# EasyEDA Pro project NUEVO board Rev. B.epro, schematic Schematic1

## Sheets
1 Power: Board Name: Carrier_1; Create Date: 2025-11-06; Page Name: Power; Project Name: 162 Carrier Board; Schematic Name: Schematic1; Update Date: 2026-01-30; Company: EasyEDA.com; Page Size: A4; Version: V1.0
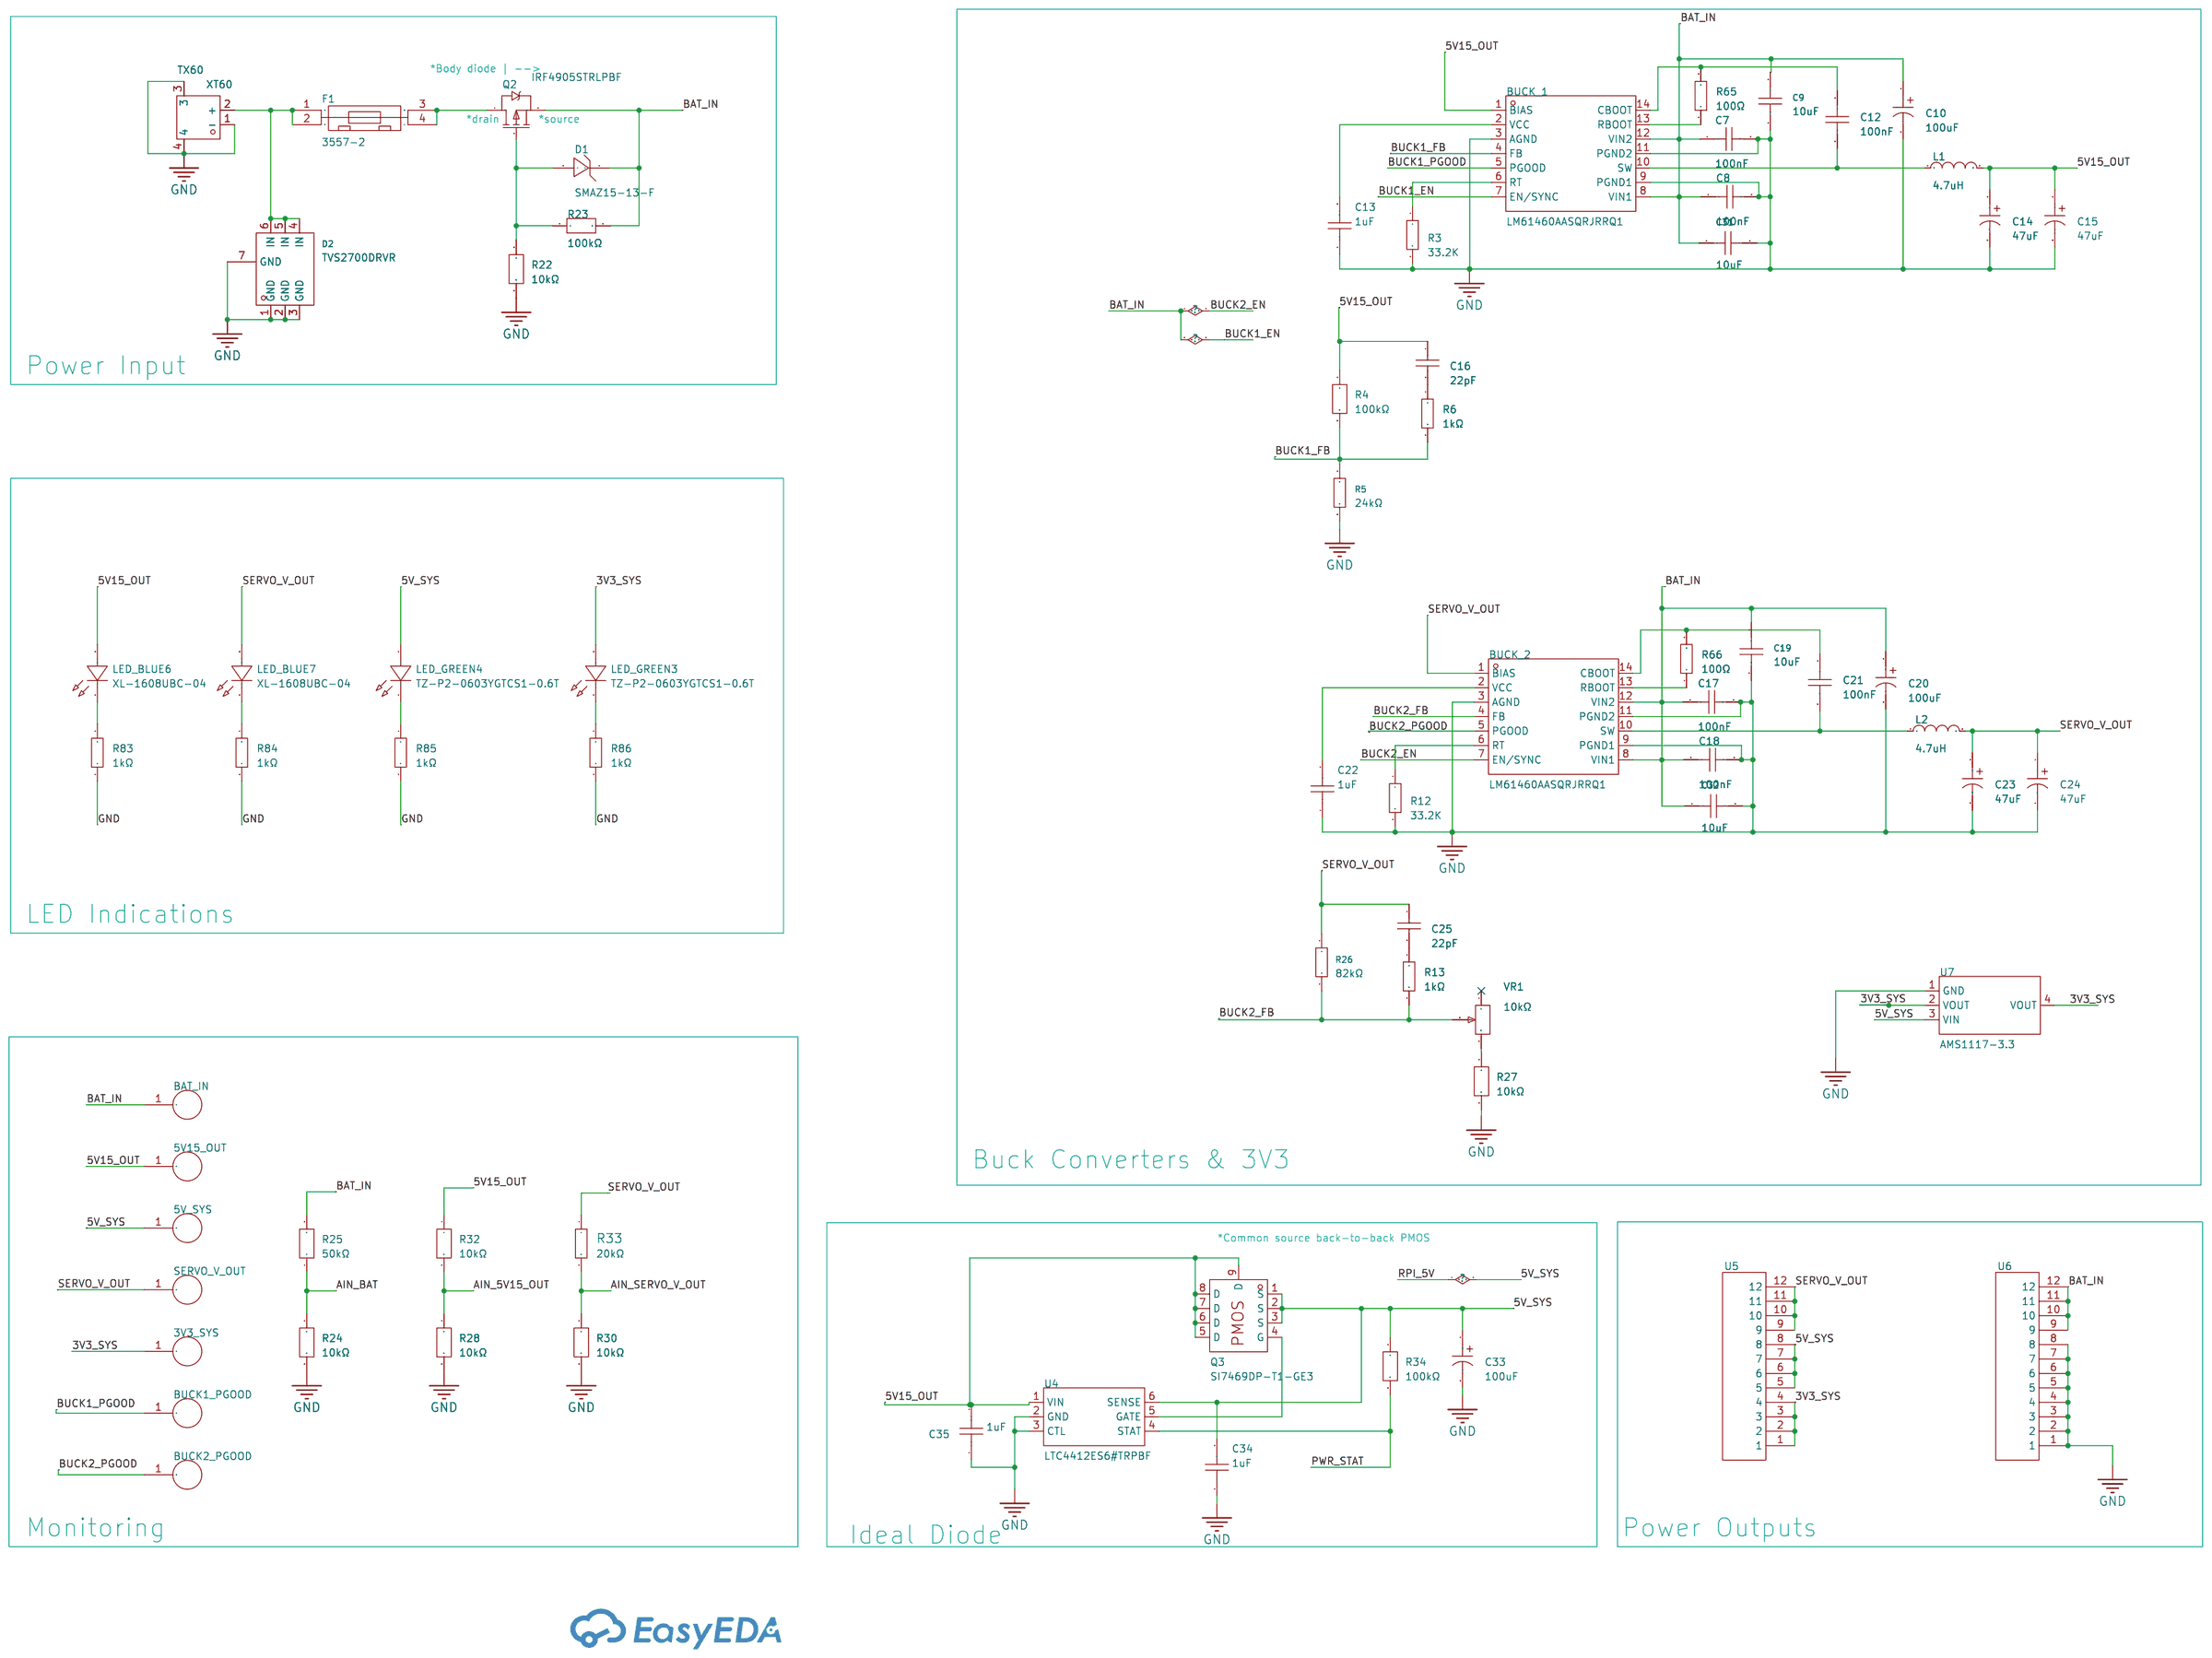
[diagram p1: Power]
2 Motors+UI: Page Name: Motors+UI; Update Date: 2026-01-31
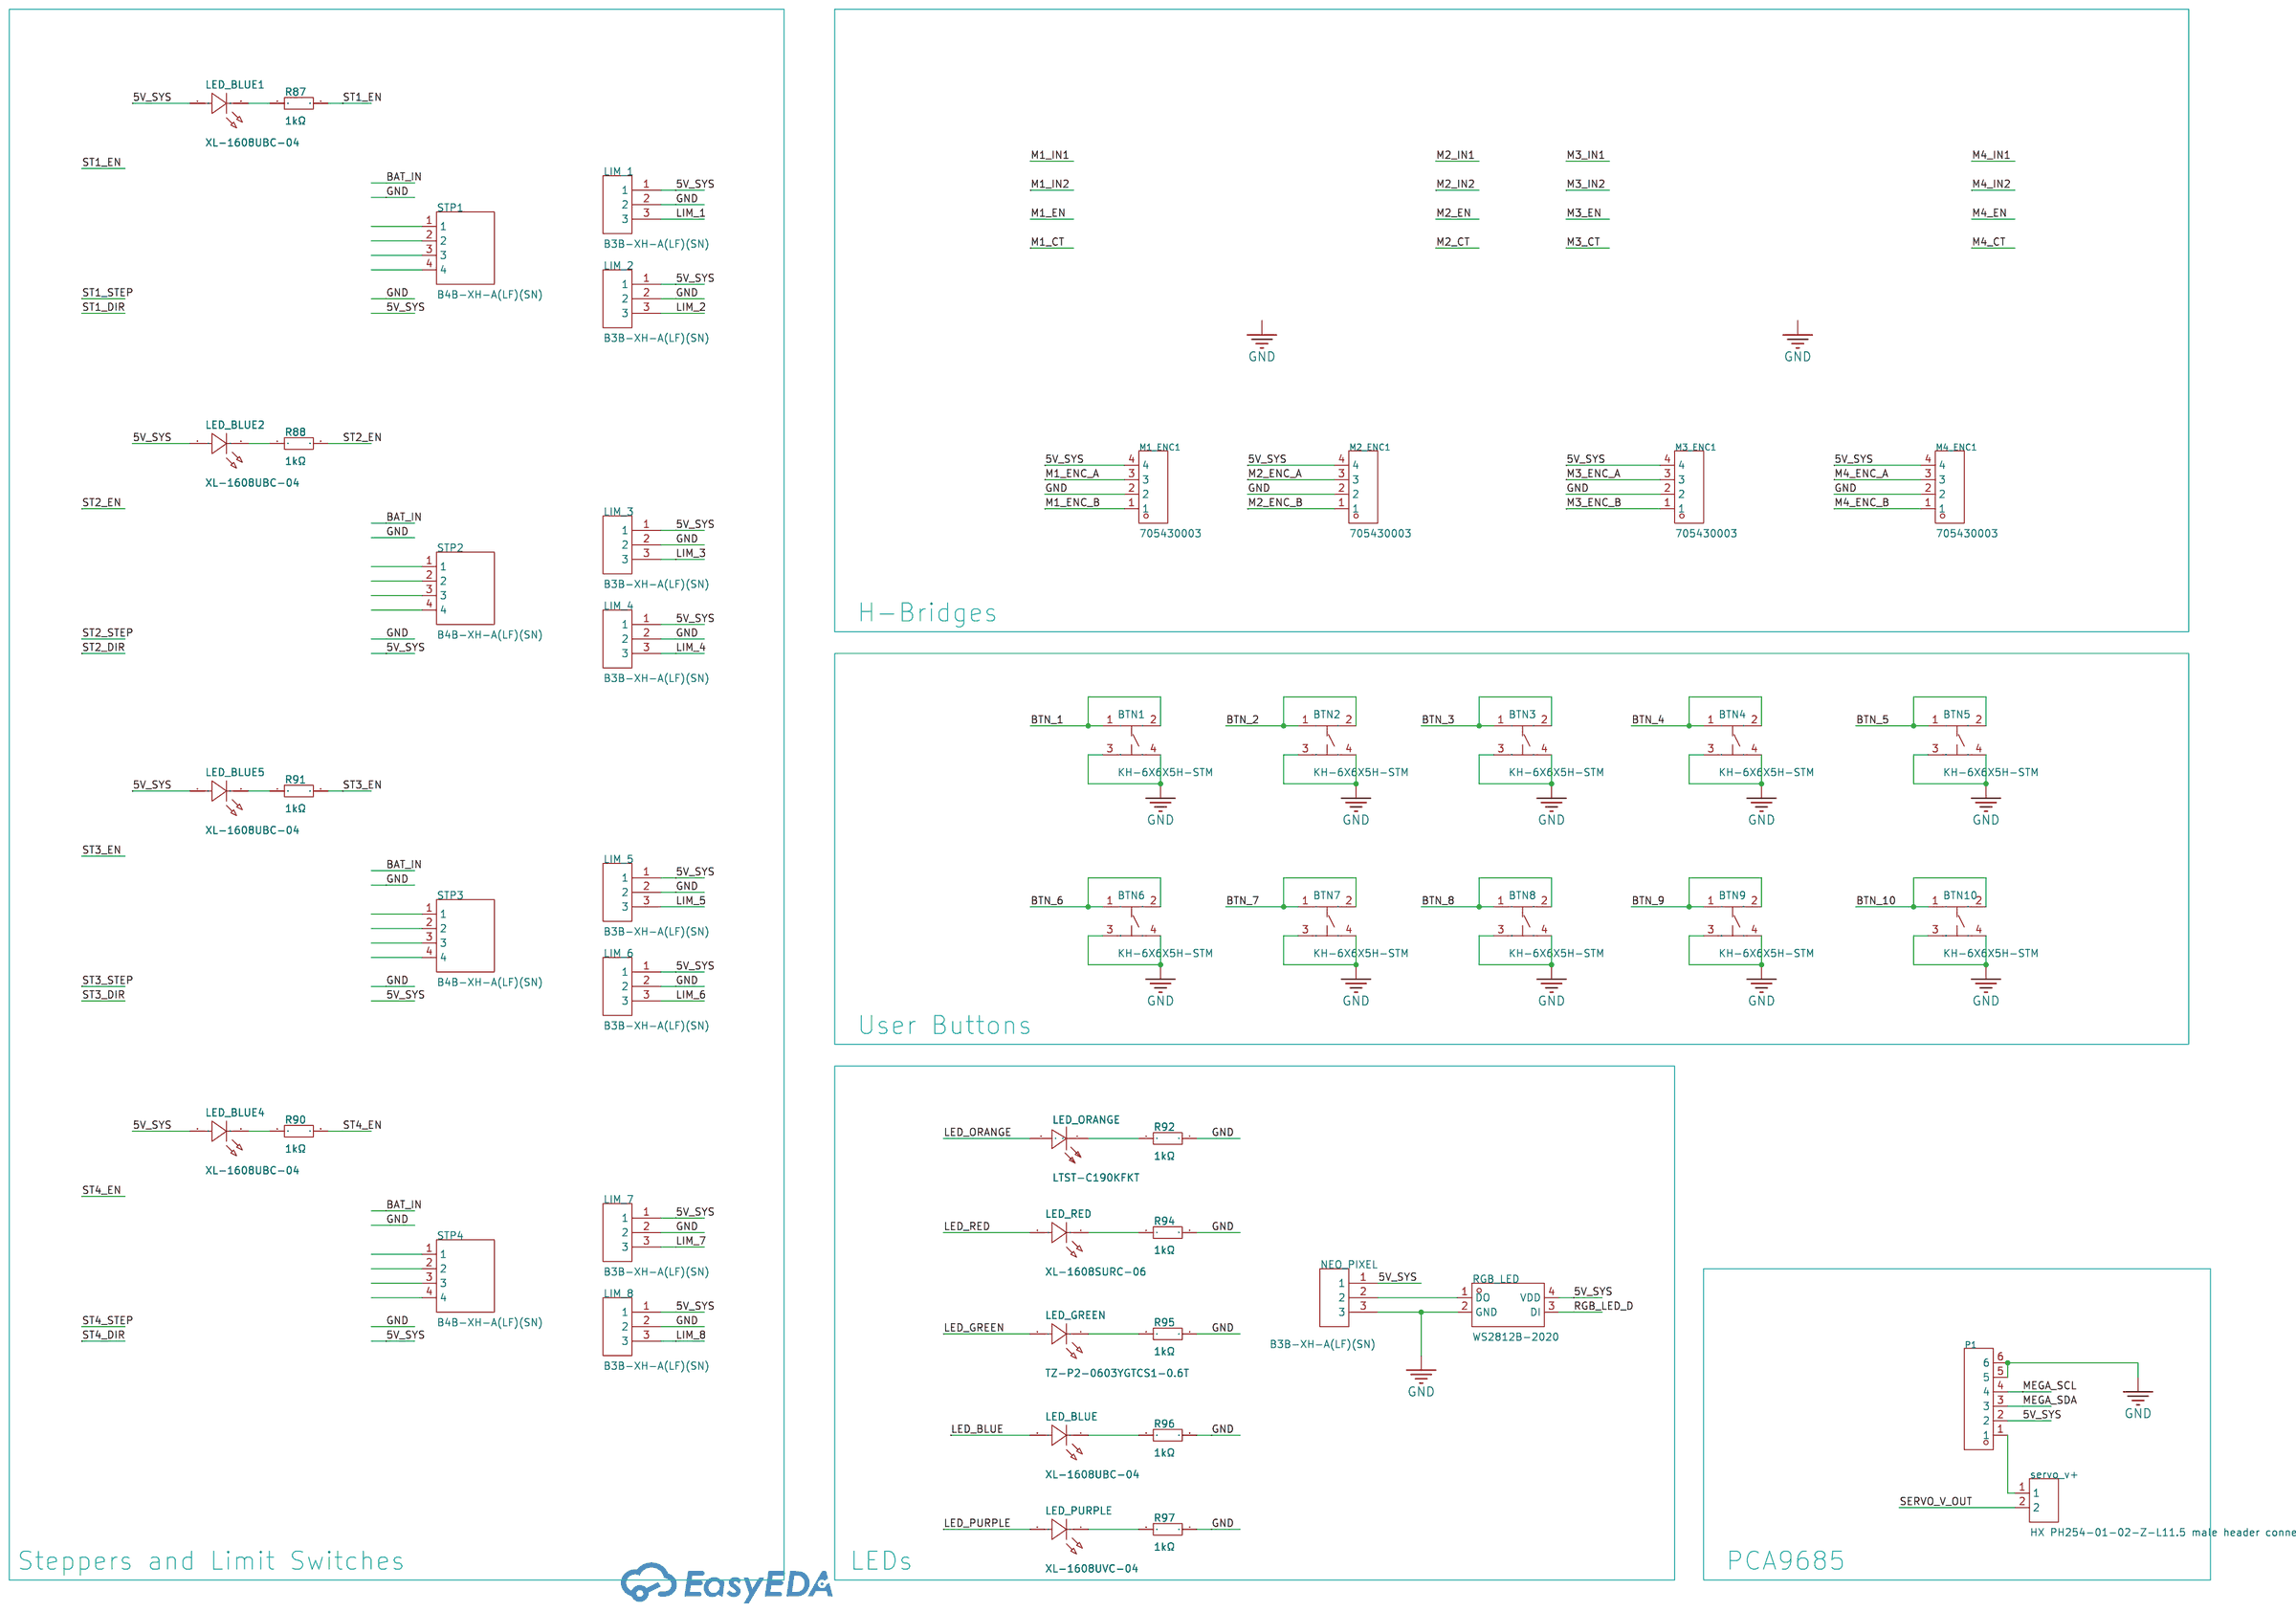
[diagram p2: Motors+UI]
3 Arduino+Rpi: Create Date: 2025-12-17; Page Name: Arduino+Rpi; Update Date: 2026-01-31
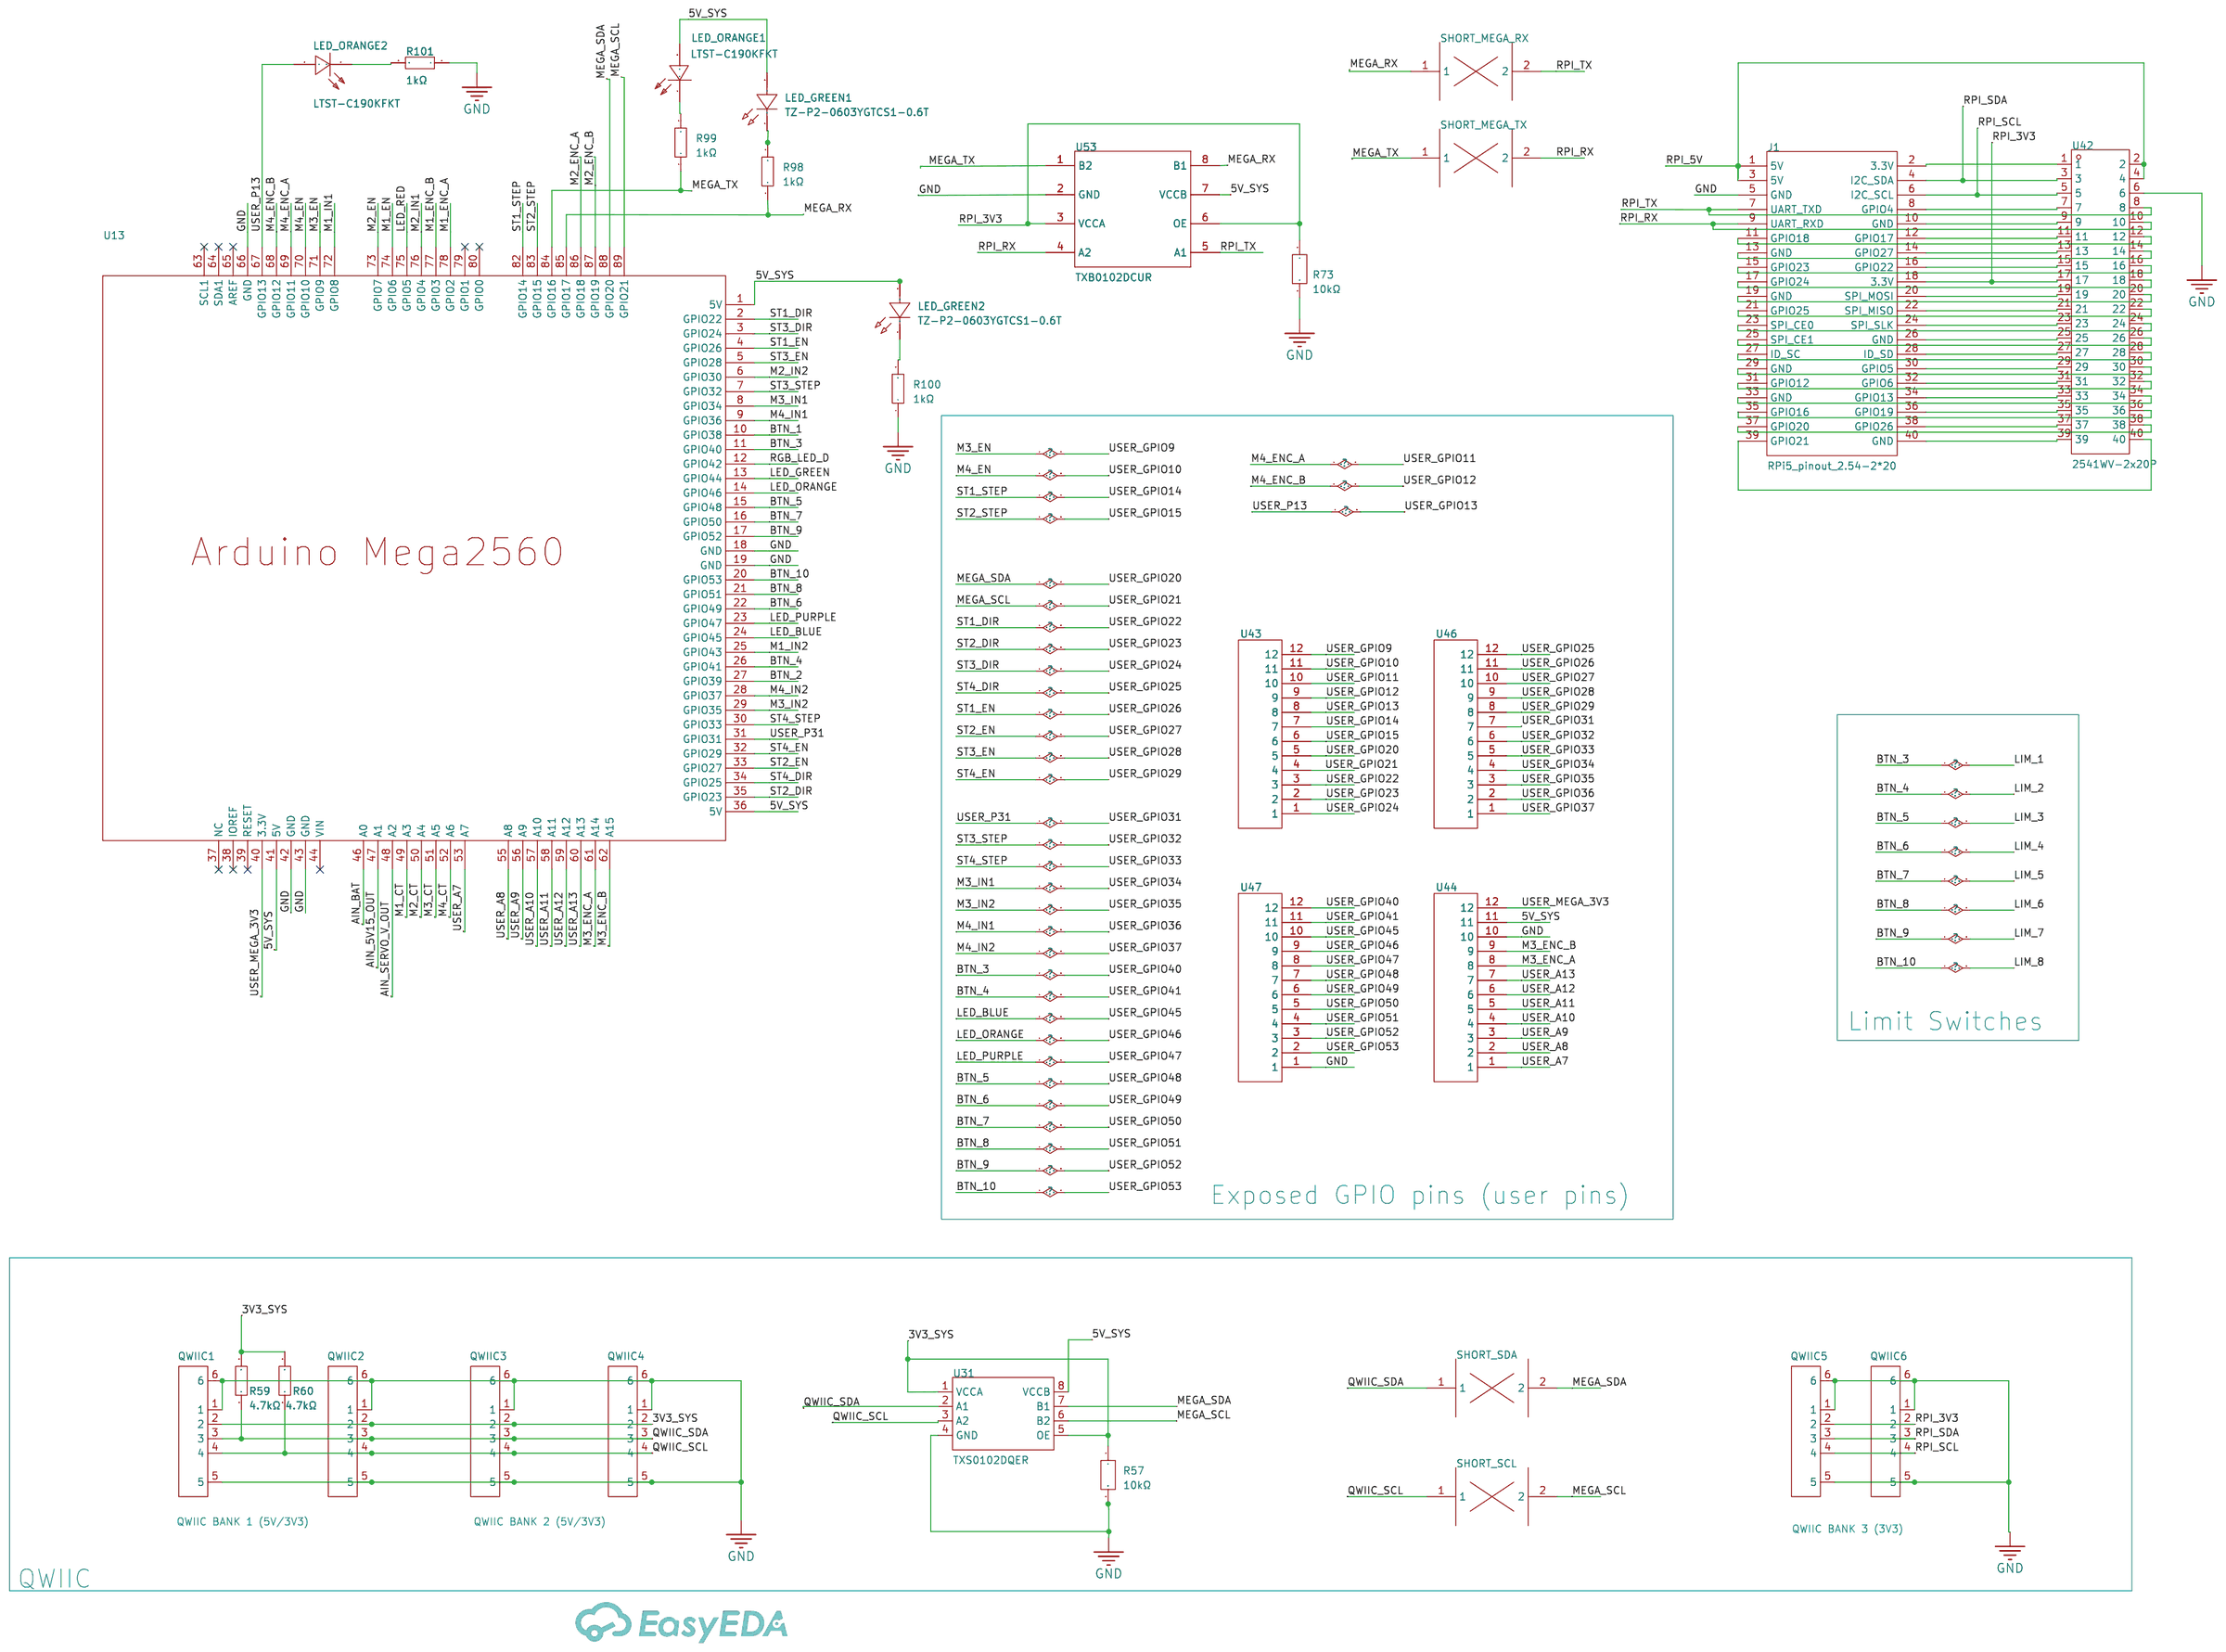
[diagram p3: Arduino+Rpi]

## Parts
sheet Arduino+Rpi
J1  RPi5_pinout_2.54-2*20  [HDR-TH_40P-P2.54-V-F-R2-C20-S2.54]
LED_GREEN1  TZ-P2-0603YGTCS1-0.6T  [LED0603-RD]
LED_GREEN2  TZ-P2-0603YGTCS1-0.6T  [LED0603-RD]
LED_ORANGE1  LTST-C190KFKT  [LED0603-RD]
LED_ORANGE2  LTST-C190KFKT  [LED0603-RD]
QWIIC1  SM04B-SRSS-TB(LF)(SN)  [CONN-SMD_4P-P1.00_SM04B-SRSS-TB-LF-SN]
QWIIC2  SM04B-SRSS-TB(LF)(SN)  [CONN-SMD_4P-P1.00_SM04B-SRSS-TB-LF-SN]
QWIIC3  SM04B-SRSS-TB(LF)(SN)  [CONN-SMD_4P-P1.00_SM04B-SRSS-TB-LF-SN]
QWIIC4  SM04B-SRSS-TB(LF)(SN)  [CONN-SMD_4P-P1.00_SM04B-SRSS-TB-LF-SN]
QWIIC5  SM04B-SRSS-TB(LF)(SN)  [CONN-SMD_4P-P1.00_SM04B-SRSS-TB-LF-SN]
QWIIC6  SM04B-SRSS-TB(LF)(SN)  [CONN-SMD_4P-P1.00_SM04B-SRSS-TB-LF-SN]
R57  10kΩ  [R0805]
R59  4.7kΩ  [R0603]
R60  4.7kΩ  [R0603]
R73  10kΩ  [R0805]
R98  1kΩ  [R0402]
R99  1kΩ  [R0402]
R100  1kΩ  [R0402]
R101  1kΩ  [R0402]
SHORT_MEGA_RX  -  [debug_shortcut]  (no BOM)
SHORT_MEGA_TX  -  [debug_shortcut]  (no BOM)
SHORT_SCL  -  [debug_shortcut]  (no BOM)
SHORT_SDA  -  [debug_shortcut]  (no BOM)
U13  -  [Mega2560 Carrier]
U31  TXS0102DQER  [X2SON-8_L1.4-W1.0-P0.35-BL]
U42  2541WV-2x20P  [HDR-TH_40P-P2.54-V-M-R2-C20-S2.54]
U43  -  [OSTTE120104]  (no BOM)
U44  -  [OSTTE120104]  (no BOM)
U46  -  [OSTTE120104]  (no BOM)
U47  -  [OSTTE120104]  (no BOM)
U53  TXB0102DCUR  [VSSOP-8_L2.4-W2.1-P0.50-LS3.2-BR]
sheet Motors+UI
BTN1  KH-6X6X5H-STM  [SW-SMD_4P-L6.0-W6.0-P4.50-LS9.0_H5.0]
BTN2  KH-6X6X5H-STM  [SW-SMD_4P-L6.0-W6.0-P4.50-LS9.0_H5.0]
BTN3  KH-6X6X5H-STM  [SW-SMD_4P-L6.0-W6.0-P4.50-LS9.0_H5.0]
BTN4  KH-6X6X5H-STM  [SW-SMD_4P-L6.0-W6.0-P4.50-LS9.0_H5.0]
BTN5  KH-6X6X5H-STM  [SW-SMD_4P-L6.0-W6.0-P4.50-LS9.0_H5.0]
BTN6  KH-6X6X5H-STM  [SW-SMD_4P-L6.0-W6.0-P4.50-LS9.0_H5.0]
BTN7  KH-6X6X5H-STM  [SW-SMD_4P-L6.0-W6.0-P4.50-LS9.0_H5.0]
BTN8  KH-6X6X5H-STM  [SW-SMD_4P-L6.0-W6.0-P4.50-LS9.0_H5.0]
BTN9  KH-6X6X5H-STM  [SW-SMD_4P-L6.0-W6.0-P4.50-LS9.0_H5.0]
BTN10  KH-6X6X5H-STM  [SW-SMD_4P-L6.0-W6.0-P4.50-LS9.0_H5.0]
CBB5  -
CBB6  -
LED_BLUE  XL-1608UBC-04  [LED0603-RD_BLUE]
LED_BLUE1  XL-1608UBC-04  [LED0603-RD_BLUE]
LED_BLUE2  XL-1608UBC-04  [LED0603-RD_BLUE]
LED_BLUE4  XL-1608UBC-04  [LED0603-RD_BLUE]
LED_BLUE5  XL-1608UBC-04  [LED0603-RD_BLUE]
LED_GREEN  TZ-P2-0603YGTCS1-0.6T  [LED0603-RD]
LED_ORANGE  LTST-C190KFKT  [LED0603-RD]
LED_PURPLE  XL-1608UVC-04  [LED0603-RD_PINK]
LED_RED  XL-1608SURC-06  [LED0603-RD_RED]
LIM_1  B3B-XH-A(LF)(SN)  [CONN-TH_3P-P2.50_A2501WV2-3P]
LIM_2  B3B-XH-A(LF)(SN)  [CONN-TH_3P-P2.50_A2501WV2-3P]
LIM_3  B3B-XH-A(LF)(SN)  [CONN-TH_3P-P2.50_A2501WV2-3P]
LIM_4  B3B-XH-A(LF)(SN)  [CONN-TH_3P-P2.50_A2501WV2-3P]
LIM_5  B3B-XH-A(LF)(SN)  [CONN-TH_3P-P2.50_A2501WV2-3P]
LIM_6  B3B-XH-A(LF)(SN)  [CONN-TH_3P-P2.50_A2501WV2-3P]
LIM_7  B3B-XH-A(LF)(SN)  [CONN-TH_3P-P2.50_A2501WV2-3P]
LIM_8  B3B-XH-A(LF)(SN)  [CONN-TH_3P-P2.50_A2501WV2-3P]
M1_ENC1  705430003  [CONN-TH_705430003]
M2_ENC1  705430003  [CONN-TH_705430003]
M3_ENC1  705430003  [CONN-TH_705430003]
M4_ENC1  705430003  [CONN-TH_705430003]
NEO_PIXEL  B3B-XH-A(LF)(SN)  [CONN-TH_3P-P2.50_A2501WV2-3P]
P1  2.54-1*6P母  [HDR-TH_6P-P2.54-V-F]
R87  1kΩ  [R0402]
R88  1kΩ  [R0402]
R90  1kΩ  [R0402]
R91  1kΩ  [R0402]
R92  1kΩ  [R0402]
R94  1kΩ  [R0402]
R95  1kΩ  [R0402]
R96  1kΩ  [R0402]
R97  1kΩ  [R0402]
RGB_LED  WS2812B-2020  [LED-SMD_4P-L2.0-W2.0-TL_WS2812B-2020]
servo_v+  HX PH254-01-02-Z-L11.5 male header connector  [HDR-TH_2P-P2.54-V-M]
ST1  -
ST2  -
ST3  -
ST4  -
STP1  B4B-XH-A(LF)(SN)  [CONN-TH_B4B-XH-A-LF-SN]
STP2  B4B-XH-A(LF)(SN)  [CONN-TH_B4B-XH-A-LF-SN]
STP3  B4B-XH-A(LF)(SN)  [CONN-TH_B4B-XH-A-LF-SN]
STP4  B4B-XH-A(LF)(SN)  [CONN-TH_B4B-XH-A-LF-SN]
sheet Power
3V3_SYS  -  [2mm_exposure]  (no BOM)
5V15_OUT  -  [2mm_exposure]  (no BOM)
5V_SYS  -  [2mm_exposure]  (no BOM)
BAT_IN  -  [2mm_exposure]  (no BOM)
BUCK1_PGOOD  -  [2mm_exposure]  (no BOM)
BUCK2_PGOOD  -  [2mm_exposure]  (no BOM)
BUCK_1  LM61460AASQRJRRQ1  [VQFN-14-HR_L4.0-W3.5-TL_LM61460AASQRJRRQ1]
BUCK_2  LM61460AASQRJRRQ1  [VQFN-14-HR_L4.0-W3.5-TL_LM61460AASQRJRRQ1]
C7  100nF  [C0402]
C8  100nF  [C0402]
C9  10uF  [C1206]
C10  100uF  [CAP-SMD_BD6.3-L6.6-W6.6-LS7.2-FD]
C12  100nF  [C0402]
C13  1uF  [C0805]
C14  47uF  [CAP-SMD_BD4.0-L4.3-W4.3-FD-LS5.5]
C15  47uF  [CAP-SMD_BD4.0-L4.3-W4.3-FD-LS5.5]
C16  22pF  [C0402]
C17  100nF  [C0402]
C18  100nF  [C0402]
C19  10uF  [C1206]
C20  100uF  [CAP-SMD_BD6.3-L6.6-W6.6-LS7.2-FD]
C21  100nF  [C0402]
C22  1uF  [C0805]
C23  47uF  [CAP-SMD_BD4.0-L4.3-W4.3-FD-LS5.5]
C24  47uF  [CAP-SMD_BD4.0-L4.3-W4.3-FD-LS5.5]
C25  22pF  [C0402]
C31  10uF  [C1206]
C32  10uF  [C1206]
C33  100uF  [CAP-SMD_BD6.3-L6.6-W6.6-LS7.2-FD]
C34  1uF  [C0805]
C35  1uF  [C0805]
D1  SMAZ15-13-F  [SMA_L4.3-W2.6-LS5.2-RD]
D2  TVS2700DRVR  [WSON-6_L2.0-W2.0-P0.65-BL-EP]
F1  3557-2  [FUSE-TH_4P-L19.8-W6.7_3557-2]
L1  4.7uH  [IND-SMD_L11.0-W10.0]
L2  4.7uH  [IND-SMD_L11.0-W10.0]
LED_BLUE6  XL-1608UBC-04  [LED0603-RD_BLUE]
LED_BLUE7  XL-1608UBC-04  [LED0603-RD_BLUE]
LED_GREEN3  TZ-P2-0603YGTCS1-0.6T  [LED0603-RD]
LED_GREEN4  TZ-P2-0603YGTCS1-0.6T  [LED0603-RD]
Q2  IRF4905STRLPBF  [D2PAK_L9.1-W10.0-P2.54-LS15.3-TL]
Q3  SI7469DP-T1-GE3  [POWERPAK-SO-8_L5.9-W4.9-P1.27-BL-EP]
R3  33.2K  [R0402]
R4  100kΩ  [R0603]
R5  24kΩ  [R0603]
R6  1kΩ  [R0603]
R12  33.2K  [R0402]
R13  1kΩ  [R0603]
R22  10kΩ  [R0805]
R23  100kΩ  [R0603]
R24  10kΩ  [R0805]
R25  50kΩ  [R0805]
R26  82kΩ  [R0603]
R27  10kΩ  [R0805]
R28  10kΩ  [R0805]
R30  10kΩ  [R0805]
R32  10kΩ  [R0805]
R33  20kΩ  [R0603]
R34  100kΩ  [R0603]
R65  100Ω  [R0402]
R66  100Ω  [R0402]
R83  1kΩ  [R0603]
R84  1kΩ  [R0603]
R85  1kΩ  [R0603]
R86  1kΩ  [R0603]
SERVO_V_OUT  -  [2mm_exposure]  (no BOM)
TX60  XT60  [CONN-TH_XT60PW-M]
U4  LTC4412ES6#TRPBF  [TSOT-23-6_L2.9-W1.6-P0.95-LS2.8-BR]
U5  -  [OSTTE120104]  (no BOM)
U6  -  [OSTTE120104]  (no BOM)
U7  AMS1117-3.3  [SOT-223-3_L6.5-W3.4-P2.30-LS7.0-BR]
VR1  10kΩ  [RES-ADJ-TH_3362P]

## Library data of the parts
J1 = 2.54-2*20: Holes Structure:2x20P Pitch:2.54mm Row Spacing:2.54mm Circular Hole / Square Hole:Square Hole Mounting Type:Through Hole Number of Rows:2 Number of Positions:40P Current Rating:2.5A Voltage Rating (Max):- Holes Direction:Top Insulation Height:8.5mm Operat; LCSC Part Name: 间距:2.54mm 2x20P 直插; Supplier Part: C2977589; Manufacturer: ZHOURI(洲日); Supplier Footprint: 插件,P=2.54mm; JLCPCB Part Class: Extended Part; Datasheet: https://item.szlcsc.com/datasheet/2.54-2*20/3388941.html; Supplier: LCSC; Holes Structure: 2x20P; Pitch: 2.54mm; Row Spacing: 2.54mm; Circular Hole / Square Hole: Square Hole; Mounting Type: Through Hole; Number of Rows: 2; Number of Positions: 40P; Current Rating: 2.5A; Holes Direction: Top; Insulation Height: 8.5mm; Operating Temperature: -40℃~+105℃
LED_GREEN LED_GREEN1-LED_GREEN4 = TZ-P2-0603YGTCS1-0.6T: Illumination Color:Green Voltage - Forward(Vf):1.9V~2.4V Voltage - Forward(Vf):1.9V~2.4V Power(Watts):60mW Forward Current:20mA Wavelength - Dominant:570nm~575nm Wavelength - Dominant:570nm~575nm Peak Wavelength:574nm Diode Configuration:- Lens Color:Wate; LCSC Part Name: 普绿/黄绿; Supplier Part: C916074; Manufacturer: TUOZHAN(拓展光电); Supplier Footprint: 0603; JLCPCB Part Class: Extended Part; Datasheet: https://item.szlcsc.com/datasheet/TZ-P2-0603YGTCS1-0.6T/990102.html; Supplier: LCSC; Illumination Color: Green; Voltage - Forward(Vf): 1.9V~2.4V; Power(Watts): 60mW; Forward Current: 20mA; Wavelength - Dominant: 570nm~575nm; Peak Wavelength: 574nm; Lens Color: Water Clear; Luminous Intensity: 50mcd; Viewing Angle: 120°; Operating Temperature: -40℃~+80℃
LED_ORANGE LED_ORANGE1 LED_ORANGE2 = LTST-C190KFKT: Emitted Color:Orange Forward Voltage (VF):2V Forward Voltage (VF):2V Power Dissipation:75mW Forward Current:20mA Dominant Wavelength:605nm Dominant Wavelength:605nm Peak Wavelength:611nm Diode Configuration:- Lens Color:Colorless Transparent Lens Color Te; LCSC Part Name: 橙灯; Supplier Part: C157740; Manufacturer: LITEON(光宝); Supplier Footprint: 0603; Datasheet: https://atta.szlcsc.com/upload/public/pdf/source/20180224/C157740_15194362109031363470.PDF; Supplier: LCSC; Emitted Color: Orange; Forward Voltage (VF): 2V; Power Dissipation: 75mW; Forward Current: 20mA; Dominant Wavelength: 605nm; Peak Wavelength: 611nm; Lens Color: Colorless Transparent Lens; Luminous Intensity: 90mcd; Viewing Angle: 130°; Operating Temperature: -35℃~+85℃
QWIIC1-QWIIC6 = SM04B-SRSS-TB(LF)(SN): Pins Structure:1x4P Pitch:1mm Mounting Type:Surface Mount, Right Angle Reference Series:SH Number of Pins:4P Number of Rows:1 Number of PINs Per Row:4 Row Spacing:- Current Rating:1A Contact Material:Copper Alloy Contact Plating:Tin Operating Temperature:; LCSC Part Name: 1x4P 间距:1mm 卧贴 系列:SH; Supplier Part: C160404; Manufacturer: JST; Supplier Footprint: SMD,P=1mm,卧贴; JLCPCB Part Class: Extended Part; Datasheet: https://item.szlcsc.com/datasheet/SM04B-SRSS-TB(LF)(SN)/171784.html; Supplier: LCSC; Pins Structure: 1x4P; Pitch: 1mm; Mounting Type: Surface Mount, Right Angle; Reference Series: SH; Number of Pins: 4P; Number of Rows: 1; Number of PINs Per Row: 4; Current Rating: 1A; Contact Material: Copper Alloy; Contact Plating: Tin; Operating Temperature: -25℃~+85℃; Voltage Rating: 50V; Plastic Material: PA; Flame Retardant Rating: UL94V-0; Supplementary Features: Auxiliary Solder Pin; Color: White; Z-Height of the Board: 2.9mm; X-Length of Bottom Edge on Board (Spacing Line): 6mm; Y-Width of Bottom Edge on Board: 4.32mm
R22 R24 R27 R28 R30 R32 R57 R73 = SCR0805J10K: Type:Thick Film Resistors Resistance: Tolerance:±5% Tolerance:±5% Power(Watts): Overload Voltage (Max): Operating Temperature Range:-55℃~+155℃ Operating Temperature Range:-55℃~+155℃; LCSC Part Name: 厚膜电阻 10kΩ ±5% 125mW; Supplier Part: C5140188; Manufacturer: VO(翔胜); Supplier Footprint: 0805; JLCPCB Part Class: Extended Part; Datasheet: https://atta.szlcsc.com/upload/public/pdf/source/20220823/E5DDB4243192CD3C8AE9677163F934FF.pdf; Supplier: LCSC; Type: Thick Film Resistors; Tolerance: ±5%; Operating Temperature Range: -55℃~+155℃
R59 R60 = 0603WAF4701T5E: Type:Thick Film Resistor Resistance:4.7kΩ Tolerance:±1% Tolerance:±1% Power(Watts):100mW Voltage-Supply(Max):75V Temperature Coefficient:±100ppm/℃ Temperature Coefficient:±100ppm/℃ Operating Temperature:-55℃~+155℃ Operating Temperature:-55℃~+155℃; LCSC Part Name: 4.7kΩ ±1% 100mW 厚膜电阻; Supplier Part: C23162; Manufacturer: UNI-ROYAL(厚声); Supplier Footprint: 0603; JLCPCB Part Class: Basic Part; Datasheet: https://item.szlcsc.com/datasheet/0603WAF4701T5E/23889.html; Supplier: LCSC; Type: Thick Film Resistor; Tolerance: ±1%; Power(Watts): 100mW; Voltage-Supply(Max): 75V; Temperature Coefficient: ±100ppm/℃; Operating Temperature: -55℃~+155℃
R87 R88 R90-R92 R94-R101 = 0402WGF1001TCE: Type:Thick Film Resistor Resistance:1kΩ Tolerance:±1% Tolerance:±1% Power(Watts):62.5mW Voltage-Supply(Max):50V Temperature Coefficient:±100ppm/℃ Temperature Coefficient:±100ppm/℃ Operating Temperature:-55℃~+155℃ Operating Temperature:-55℃~+155℃; LCSC Part Name: 1kΩ ±1% 62.5mW 厚膜电阻; Supplier Part: C11702; Manufacturer: UNI-ROYAL(厚声); Supplier Footprint: 0402; JLCPCB Part Class: Basic Part; Datasheet: https://item.szlcsc.com/datasheet/0402WGF1001TCE/12256.html; Supplier: LCSC; Type: Thick Film Resistor; Tolerance: ±1%; Power(Watts): 62.5mW; Voltage-Supply(Max): 50V; Temperature Coefficient: ±100ppm/℃; Operating Temperature: -55℃~+155℃
SHORT_MEGA_RX SHORT_MEGA_TX SHORT_SCL SHORT_SDA = debug_shortcut
U13 = Mega2560 Carrier
U31 = TXS0102DQER: Channel Type:Bidirectional Input Signal:- Output Signal:- Data Rate:24Mbps Voltage - Supply(VCCA):1.65V~3.6V Voltage - Supply(VCCA):1.65V~3.6V Voltage - Supply(VCCB):2.3V~5.5V Voltage - Supply(VCCB):2.3V~5.5V Number of Elements:1 Number of Circuits:2 Outp; LCSC Part Name: 24Mbps 2位双向电平转换器; Supplier Part: C2652935; Manufacturer: TI(德州仪器); Supplier Footprint: X2-SON-8(1x1.4); JLCPCB Part Class: Extended Part; Datasheet: https://www.ti.com/cn/lit/gpn/txs0102; Supplier: LCSC; Channel Type: Bidirectional; Data Rate: 24Mbps; Voltage - Supply(VCCA): 1.65V~3.6V; Voltage - Supply(VCCB): 2.3V~5.5V; Number of Elements: 1; Number of Circuits: 2; Output Type: Open Drain；Push-Pull; Operating Temperature: -40℃~+85℃; Features: Auto Direction Detection
U42 = 2541WV-2x20P: Pin Structure:2x20P Pitch:2.54mm Circluar Pins/Square Pins:Pin Header Mounting Type:Through Hole Number of Rows:2 Number of Pins:40P Length of Mating Pin:6mm Insulation Height:2.54mm Length of End Connection Pin:3mm Contact Plating:Gold Operating Temperat; LCSC Part Name: 2x20P 间距:2.54mm 方针 直插; Supplier Part: C25503140; Manufacturer: HanElectricity(瀚源); Supplier Footprint: 插件,P=2.54mm; Datasheet: https://item.szlcsc.com/datasheet/2541WV-2x20P/27233683.html; Supplier: LCSC; Pin Structure: 2x20P; Pitch: 2.54mm; Circluar Pins/Square Pins: Pin Header; Mounting Type: Through Hole; Number of Rows: 2; Number of Pins: 40P; Length of Mating Pin: 6mm; Insulation Height: 2.54mm; Length of End Connection Pin: 3mm; Contact Plating: Gold; Operating Temperature: -55℃~+105℃
U5 U6 U43 U44 U46 U47 = OSTTE120104: Screw Wire-to-board Terminal Block 12 position
U53 = TXB0102DCUR: Channel Type:Bidirectional Input Signal:- Output Signal:- Data Rate:100Mbps Voltage - Supply(VCCA):1.2V~3.6V Voltage - Supply(VCCA):1.2V~3.6V Voltage - Supply(VCCB):1.65V~5.5V Voltage - Supply(VCCB):1.65V~5.5V Number of Circuits:1 Number of Circuits:2 Out; LCSC Part Name: 100Mbps 2位双向电平转换器; Supplier Part: C60709; Manufacturer: TI(德州仪器); Supplier Footprint: VSSOP-8-0.5mm; JLCPCB Part Class: Extended Part; Datasheet: https://www.ti.com/cn/lit/gpn/txb0102; Supplier: LCSC; Channel Type: Bidirectional; Data Rate: 100Mbps; Voltage - Supply(VCCA): 1.2V~3.6V; Voltage - Supply(VCCB): 1.65V~5.5V; Number of Circuits: 2; Output Type: Tri-State; Operating Temperature: -40℃~+85℃; Features: Automatic Direction Detection
BTN1-BTN10 = KH-6X6X5H-STM: Circuit:SPST Actuator Style:Round Button Mounting Type:Surface Mount,Vertical Length:6mm Width:6mm Switch Height:5mm with Bracket:Without Bracket Contact Current:50mA Voltage Rating:12V Actuator/Cap Color:Black Termination Style:Gull Wing Life:80,000 Cycl; LCSC Part Name: 6*6*5mm 立贴 轻触开关; Supplier Part: C2837531; Manufacturer: kinghelm(金航标); Supplier Footprint: SMD-4P,6x6mm; JLCPCB Part Class: Extended Part; Datasheet: https://item.szlcsc.com/datasheet/KH-6X6X5H-STM/3009601.html; Supplier: LCSC; Circuit: SPST; Actuator Style: Round Button; Mounting Type: Surface Mount,Vertical; Length: 6mm; Width: 6mm; Switch Height: 5mm; with Bracket: Without Bracket; Contact Current: 50mA; Voltage Rating: 12V; Actuator/Cap Color: Black; Termination Style: Gull Wing; Life: 80,000 Cycles
LED_BLUE LED_BLUE1 LED_BLUE2 LED_BLUE4-LED_BLUE7 = XL-1608UBC-04: Lamp Holder Type:- Illumination Color:Blue Voltage - Forward(Vf):3.3V Voltage - Forward(Vf):3.3V Power(Watts):70mW Forward Current:20mA Wavelength - Dominant:455nm~475nm Wavelength - Dominant:455nm~475nm Peak Wavelength:470nm Diode Configuration:- Lens Co; LCSC Part Name: 0603蓝色贴片式发光二极管; Supplier Part: C965807; Manufacturer: XINGLIGHT(成兴光); Supplier Footprint: 0603; JLCPCB Part Class: Extended Part; Datasheet: https://item.szlcsc.com/datasheet/XL-1608UBC-04/1051416.html; Supplier: LCSC; Illumination Color: Blue; Voltage - Forward(Vf): 3.3V; Power(Watts): 70mW; Forward Current: 20mA; Wavelength - Dominant: 455nm~475nm; Peak Wavelength: 470nm; Lens Color: Water Clear; Luminous Intensity: 300mcd; Viewing Angle: 120°; Mounting Style: op View Mount
LED_PURPLE = XL-1608UVC-04: Lamp Holder Type:- Illumination Color:Purple Voltage - Forward(Vf):3.4V Voltage - Forward(Vf):3.4V Power(Watts):100mW Forward Current:5mA Wavelength - Dominant:- Wavelength - Dominant:- Peak Wavelength:405nm Diode Configuration:- Lens Color:Water Clear Co; LCSC Part Name: 紫色; Supplier Part: C7371898; Manufacturer: XINGLIGHT(成兴光); Supplier Footprint: 0603; Datasheet: https://item.szlcsc.com/datasheet/XL-1608UVC-04/8342970.html; Supplier: LCSC; Illumination Color: Purple; Voltage - Forward(Vf): 3.4V; Power(Watts): 100mW; Forward Current: 5mA; Peak Wavelength: 405nm; Lens Color: Water Clear; Luminous Intensity: 60mcd; Viewing Angle: 120°; Mounting Style: op View Mount; Operating Temperature: -40℃~+85℃
LED_RED = XL-1608SURC-06: Lamp Holder Type:- Illumination Color:Red Voltage - Forward(Vf):2.3V Voltage - Forward(Vf):2.3V Power(Watts):50mW Forward Current:20mA Wavelength - Dominant:620nm~630nm Wavelength - Dominant:620nm~630nm Peak Wavelength:625nm Diode Configuration:- Lens Col; LCSC Part Name: 0603红色贴片式发光二极管; Supplier Part: C965799; Manufacturer: XINGLIGHT(成兴光); Supplier Footprint: 0603; JLCPCB Part Class: Extended Part; Datasheet: https://item.szlcsc.com/datasheet/XL-1608SURC-06/1051408.html; Supplier: LCSC; Illumination Color: Red; Voltage - Forward(Vf): 2.3V; Power(Watts): 50mW; Forward Current: 20mA; Wavelength - Dominant: 620nm~630nm; Peak Wavelength: 625nm; Lens Color: Water Clear; Luminous Intensity: 225mcd; Viewing Angle: 120°; Mounting Style: op View Mount; Operating Temperature: -40℃~+85℃
LIM_1-LIM_8 NEO_PIXEL = B3B-XH-A(LF)(SN): Pins Structure:1x3P Pitch:2.5mm Mounting Type:Through Hole Reference Series:XH Number of Pins:3P Number of Rows:1 Number of PINs Per Row:3 Row Spacing:- Current Rating:3A Contact Material:Brass Contact Plating:Tin Operating Temperature:-25℃~+85℃ Operating; LCSC Part Name: 1x3P 间距:2.5mm 直插 系列:XH; Supplier Part: C144394; Manufacturer: JST; Supplier Footprint: 插件,P=2.5mm; Datasheet: https://item.szlcsc.com/datasheet/B3B-XH-A(LF)(SN)/155726.html; Supplier: LCSC; Pins Structure: 1x3P; Pitch: 2.5mm; Mounting Type: Through Hole; Reference Series: XH; Number of Pins: 3P; Number of Rows: 1; Number of PINs Per Row: 3; Current Rating: 3A; Contact Material: Brass; Contact Plating: Tin; Operating Temperature: -25℃~+85℃; Voltage Rating: 250V; Plastic Material: PA66; Flame Retardant Rating: UL94V-0; Supplementary Features: K Pin; Color: White; Z-Height of the Board: 7mm; X-Length of Bottom Edge on Board (Spacing Line): 9.9mm; Y-Width of Bottom Edge on Board: 5.75mm
M1_ENC1 M2_ENC1 M3_ENC1 M4_ENC1 = 705430003: Pins Structure:1x4P Pitch:2.54mm Mounting Type:Through Hole Reference Series:- Number of Pins:4P Number of Rows:1 Number of PINs Per Row:4 Row Spacing:- Current Rating:3A Contact Plating:Gold Operating Temperature:-40℃~+105℃ Operating Temperature:-40℃~+10; LCSC Part Name: 1x4P 间距:2.54mm 直插; Supplier Part: C293663; Manufacturer: MOLEX; Supplier Footprint: 插件,P=2.54mm; JLCPCB Part Class: Extended Part; Datasheet: https://www.molex.com/content/dam/molex/molex-dot-com/products/automated/en-us/salesdrawingpdf/705/70543/705430003_sd.pdf?inline; Supplier: LCSC; Pins Structure: 1x4P; Pitch: 2.54mm; Mounting Type: Through Hole; Number of Pins: 4P; Number of Rows: 1; Number of PINs Per Row: 4; Current Rating: 3A; Contact Plating: Gold; Operating Temperature: -40℃~+105℃; Voltage Rating: 250V; Flame Retardant Rating: UL94V-0; Color: Black
P1 = 2.54-1*6P母: Holes Structure:1x6P Pitch:2.54mm Row Spacing:- Circular Hole / Square Hole:Square Hole Mounting Type:Through Hole Number of Rows:1 Number of Positions:6P Current Rating:3A Voltage Rating (Max):- Holes Direction:Top Insulation Height:- Contact Material:Br; LCSC Part Name: 1x6P 间距:2.54mm 直插; Supplier Part: C40877; Manufacturer: BOOMELE(博穆精密); Supplier Footprint: 插件,P=2.54mm; Datasheet: https://item.szlcsc.com/datasheet/2.54-1*6P%25E6%25AF%258D/41861.html; Supplier: LCSC; Holes Structure: 1x6P; Pitch: 2.54mm; Circular Hole / Square Hole: Square Hole; Mounting Type: Through Hole; Number of Rows: 1; Number of Positions: 6P; Current Rating: 3A; Holes Direction: Top; Contact Material: Brass; Operating Temperature: -40℃~+105℃; PIN Length: 3.3mm
RGB_LED = WS2812B-2020: Wavelength:515.6nm；622.5nm；470.4nm Luminous Intensity:200mcd；160mcd；520mcd Fixed-Frequency Pwm Mode:- Data Transmission Rate:100KB/S Voltage - Supply:5V Voltage - Supply:5V Quiescent Current:- Lens Color:- ESD Withstand Voltage:- Installation method:op Vi; LCSC Part Name: RGB三色; Supplier Part: C965555; Manufacturer: worldsemi; Supplier Footprint: SMD,2.2x2mm; JLCPCB Part Class: Extended Part; Datasheet: https://item.szlcsc.com/datasheet/WS2812B-2020/1051115.html; Supplier: LCSC; Wavelength: 515.6nm；622.5nm；470.4nm; Luminous Intensity: 200mcd；160mcd；520mcd; Data Transmission Rate: 100KB/S; Voltage - Supply: 5V; Installation method: op View Mount
servo_v+ = HX PH254-01-02-Z-L11.5 male header connector: Pin Structure:1x2P Pitch:2.54mm Circluar Pins/Square Pins:Pin Header Mounting Type:Through Hole Number of Rows:1 Number of Pins:2P Current Rating:3A Voltage Rating (Max):1kV Length of Mating Pin:6mm Insulation Height:2.5mm Length of End Connection Pin:3mm; LCSC Part Name: 1x2P 间距:2.54mm 方针 直插; Supplier Part: C52016390; Manufacturer: hanxia(韩下); Supplier Footprint: 插件,P=2.54mm; JLCPCB Part Class: Extended Part; Datasheet: https://item.szlcsc.com/datasheet/HX%2520PH254-01-02-Z-L11.5%2520male%2520header%2520connector/54760435.html; Supplier: LCSC; Pin Structure: 1x2P; Pitch: 2.54mm; Circluar Pins/Square Pins: Pin Header; Mounting Type: Through Hole; Number of Rows: 1; Number of Pins: 2P; Current Rating: 3A; Voltage Rating (Max): 1kV; Length of Mating Pin: 6mm; Insulation Height: 2.5mm; Length of End Connection Pin: 3mm; Contact Material: Brass; Contact Plating: Gold; Operating Temperature: -40℃~+105℃
STP1-STP4 = B4B-XH-A(LF)(SN): Pins Structure:1x4P Pitch:2.5mm Mounting Type:Through Hole Reference Series:XH Number of Pins:4P Number of Rows:1 Number of PINs Per Row:4 Row Spacing:- Current Rating:3A Contact Material:Brass Contact Plating:Tin Operating Temperature:-25℃~+85℃ Operating; LCSC Part Name: 1x4P 间距:2.5mm 直插 系列:XH; Supplier Part: C144395; Manufacturer: JST; Supplier Footprint: 插件,P=2.5mm; JLCPCB Part Class: Extended Part; Datasheet: https://item.szlcsc.com/datasheet/B4B-XH-A(LF)(SN)/155727.html; Supplier: LCSC; Pins Structure: 1x4P; Pitch: 2.5mm; Mounting Type: Through Hole; Reference Series: XH; Number of Pins: 4P; Number of Rows: 1; Number of PINs Per Row: 4; Current Rating: 3A; Contact Material: Brass; Contact Plating: Tin; Operating Temperature: -25℃~+85℃; Voltage Rating: 250V; Plastic Material: PA66; Flame Retardant Rating: UL94V-0; Supplementary Features: K Pin; Color: White; Z-Height of the Board: 7mm; X-Length of Bottom Edge on Board (Spacing Line): 12.4mm; Y-Width of Bottom Edge on Board: 5.75mm
3V3_SYS 5V15_OUT 5V_SYS BAT_IN BUCK1_PGOOD BUCK2_PGOOD SERVO_V_OUT = 2mm_exposure
BUCK_1 BUCK_2 = LM61460AASQRJRRQ1: Function:Step-down type Output Type:Adjustable Input Voltage:3V~36V Input Voltage:3V~36V Output Voltage:1V~34.2V Output Voltage:1V~34.2V Output Current (Max):6A Switching Frequency:2MHz Operating Temperature:-40℃~+150℃@(TJ) Operating Temperature:-40℃~+150; Supplier Part: C1855832; Manufacturer: TI(德州仪器); Supplier Footprint: VQFN-14-HR(3.5x4); JLCPCB Part Class: Extended Part; Datasheet: https://www.ti.com/cn/lit/gpn/lm61460-q1; Supplier: LCSC; Function: Step-down type; Output Type: Adjustable; Input Voltage: 3V~36V; Output Voltage: 1V~34.2V; Output Current (Max): 6A; Switching Frequency: 2MHz; Operating Temperature: -40℃~+150℃@(TJ); Synchronous Rectification: Yes; Number of Outputs: 1; Topology: Step-down; Switch tube (built-in/external): 内置
C7 C8 C12 C17 C18 C21 = CL05B104KB54PNC: Capacitance:100nF Tolerance:±10% Tolerance:±10% Voltage Rating:50V Temperature Coefficient:X7R; LCSC Part Name: 100nF ±10% 50V; Supplier Part: C307331; Manufacturer: SAMSUNG(三星); Supplier Footprint: 0402; JLCPCB Part Class: Basic Part; Datasheet: https://item.szlcsc.com/datasheet/CL05B104KB54PNC/291005.html; Supplier: LCSC; Tolerance: ±10%; Voltage Rating: 50V; Temperature Coefficient: X7R
C9 C19 C31 C32 = CL31B106KBHNNNE: Capacitance:10uF Tolerance:±10% Tolerance:±10% Voltage Rating:50V Temperature Coefficient:X7R; LCSC Part Name: 10uF ±10% 50V; Supplier Part: C89632; Manufacturer: SAMSUNG(三星); Supplier Footprint: 1206; JLCPCB Part Class: Extended Part; Datasheet: https://item.szlcsc.com/datasheet/CL31B106KBHNNNE/90812.html; Supplier: LCSC; Tolerance: ±10%; Voltage Rating: 50V; Temperature Coefficient: X7R
C10 C20 C33 = RX100UF50V90RV0105: Capacitance:100uF Tolerance:±20% Tolerance:±20% Voltage Rating:50V Diameter:6.3mm Height - Seated (Max):7.7mm Lifetime:2000hrs@105℃ Operating Temperature:-55℃~+105℃ Operating Temperature:-55℃~+105℃; LCSC Part Name: 100uF ±20% 50V; Supplier Part: C3445238; Manufacturer: KNSCHA(科尼盛); Supplier Footprint: SMD,D6.3xL7.7mm; JLCPCB Part Class: Extended Part; Datasheet: https://item.szlcsc.com/datasheet/RX100UF50V90RV0105/4010597.html; Supplier: LCSC; Tolerance: ±20%; Voltage Rating: 50V; Diameter: 6.3mm; Height - Seated (Max): 7.7mm; Lifetime: 2000hrs@105℃; Operating Temperature: -55℃~+105℃
C13 C22 C34 C35 = CT41G-0805-2X1-50V-1uF-K(N): Capacitance:1uF Tolerance:±10% Tolerance:±10% Voltage Rating:50V Temperature Coefficient:-; LCSC Part Name: 1uF ±10% 50V; Supplier Part: C141772; Manufacturer: TORCH(火炬); Supplier Footprint: 0805; JLCPCB Part Class: Extended Part; Datasheet: https://item.szlcsc.com/datasheet/CT41G-0805-2X1-50V-1uF-K(N)/153103.html; Supplier: LCSC; Tolerance: ±10%; Voltage Rating: 50V
C14 C15 C23 C24 = RVT47UF10V67RV0174: Capacitance:47uF Tolerance:±20% Tolerance:±20% Voltage Rating:10V Ripple Current:31mA@120Hz Equivalent Series Resistance(ESR):- Diameter:4mm Height - Seated (Max):5.4mm Lifetime:2000hrs@105℃ Operating Temperature:-55℃~+105℃ Operating Temperature:-55℃~+105; LCSC Part Name: 47uF ±20% 10V; Supplier Part: C2895276; Manufacturer: KNSCHA(科尼盛); Supplier Footprint: SMD,D4xL5.4mm; JLCPCB Part Class: Extended Part; Datasheet: https://item.szlcsc.com/datasheet/RVT47UF10V67RV0174/3134648.html; Supplier: LCSC; Tolerance: ±20%; Voltage Rating: 10V; Ripple Current: 31mA@120Hz; Diameter: 4mm; Height - Seated (Max): 5.4mm; Lifetime: 2000hrs@105℃; Operating Temperature: -55℃~+105℃
C16 C25 = 0402CG220J500NT: Capacitance: Tolerance:±5% Tolerance:±5% Voltage Rated: Temperature Coefficient:; LCSC Part Name: 22pF ±5% 50V; Supplier Part: C1555; Manufacturer: FH(风华); Supplier Footprint: 0402; Datasheet: https://atta.szlcsc.com/upload/public/pdf/source/20200305/C486355_26A10D38EF8C2A5C37091D0039909270.pdf; Supplier: LCSC; Tolerance: ±5%
D1 = SMAZ15-13-F: Diode Configuration:Independent Zener Voltage(Nom):15V Reverse Leakage Current (Ir):1uA@11.4V Zener Voltage(Range):14.25V~15.75V Zener Voltage(Range):14.25V~15.75V Pd - Power Dissipation:1W Impedance(Zzt):10Ω Impedance(Zzk):150Ω Operating Junction Tempera; LCSC Part Name: 独立式 耐压:15V 电流:1uA@11.4V; Supplier Part: C110524; Manufacturer: DIODES(美台); Supplier Footprint: SMA; JLCPCB Part Class: Extended Part; Datasheet: https://item.szlcsc.com/datasheet/SMAZ15-13-F/111747.html; Supplier: LCSC; Diode Configuration: Independent; Zener Voltage(Nom): 15V; Reverse Leakage Current (Ir): 1uA@11.4V; Zener Voltage(Range): 14.25V~15.75V; Pd - Power Dissipation: 1W; Impedance(Zzt): 10Ω; Impedance(Zzk): 150Ω; Operating Junction Temperature Range: -65℃~+150℃
D2 = TVS2700DRVR: Polarity:Unidirectional Reverse Stand-Off Voltage (Vrwm):27V Clamping Voltage:34.1V Peak Pulse Current (Ipp):40A@8/20us Peak Pulse Power Dissipation (Ppp):1.25kW@8/20us Voltage - Breakdown:31.2V Reverse Leakage Current (Ir):1.8nA Operating Temperature:-40; Supplier Part: C523797; Manufacturer: TI(德州仪器); Supplier Footprint: WSON-6-EP(2x2); JLCPCB Part Class: Extended Part; Datasheet: https://www.ti.com/cn/lit/gpn/tvs2700; Supplier: LCSC; Polarity: Unidirectional; Reverse Stand-Off Voltage (Vrwm): 27V; Clamping Voltage: 34.1V; Peak Pulse Current (Ipp): 40A@8/20us; Peak Pulse Power Dissipation (Ppp): 1.25kW@8/20us; Voltage - Breakdown: 31.2V; Reverse Leakage Current (Ir): 1.8nA; Operating Temperature: -40℃~+125℃; level of protection: IEC 61000-4-5；IEC 61000-4-2; Type: TVS; Junction Capacitance: 100pF
F1 = 3557-2: Fuseholder Type:Bracket type Number of Circuits:1 Voltage Rating:500V Current Rating:30A Fuse Type:Blade; LCSC Part Name: 30A 500V 支座型; Supplier Part: C352820; Manufacturer: Keystone; JLCPCB Part Class: Extended Part; Datasheet: https://item.szlcsc.com/datasheet/3557-2/328627.html; Supplier: LCSC; Fuseholder Type: Bracket type; Number of Circuits: 1; Voltage Rating: 500V; Current Rating: 30A; Fuse Type: Blade
L1 L2 = D1040HP-4R7MT: Inductance:4.7uH Tolerance:±20% Tolerance:±20% Current - Saturation(Isat):10A DC Resistance(DCR):16.5mΩ Type:Molded Inductor; LCSC Part Name: 一体成型电感 1040-4.7UH 4.7uH ±20% 12A; Supplier Part: C41410646; Manufacturer: DEYAN(德砚电子); Supplier Footprint: SMD,11x10.1mm; JLCPCB Part Class: Extended Part; Datasheet: https://item.szlcsc.com/datasheet/D1040HP-4R7MT/43219204.html; Supplier: LCSC; Tolerance: ±20%; Current - Saturation(Isat): 10A; DC Resistance(DCR): 16.5mΩ; Type: Molded Inductor
Q2 = IRF4905STRLPBF_C2620: Number:1 P-Channel Drain to Source Voltage:55V Current - Continuous Drain(Id):70A RDS(on):20mΩ@10V Pd - Power Dissipation:170W Gate Threshold Voltage (Vgs(th)):4V@250uA Gate Charge(Qg):180nC@10V Input Capacitance(Ciss):3.5nF Reverse Transfer Capacitance (; LCSC Part Name: 1个P沟道 耐压:55V 电流:70A; Supplier Part: C2620; Manufacturer: Infineon(英飞凌); Supplier Footprint: D2PAK; JLCPCB Part Class: Extended Part; Datasheet: https://item.szlcsc.com/datasheet/IRF4905STRLPBF/2998.html; Supplier: LCSC; Number: 1 P-Channel; Drain to Source Voltage: 55V; Current - Continuous Drain(Id): 70A; RDS(on): 20mΩ@10V; Pd - Power Dissipation: 170W; Gate Threshold Voltage (Vgs(th)): 4V@250uA; Gate Charge(Qg): 180nC@10V; Input Capacitance(Ciss): 3.5nF; Reverse Transfer Capacitance (Crss@Vds): 450pF; Operating Temperature: -55℃~+150℃; Output Capacitance(Coss): 1.25nF
Q3 = SI7469DP-T1-GE3: Type:1 Piece P-Channel Drain Source Voltage (Vdss): Continuous Drain Current (Id): Drain Source On Resistance (RDS(on)@Vgs,Id):0.025Ω@10V,28A Power Dissipation (Pd): Gate Threshold Voltage (Vgs(th)@Id): Total Gate Charge (Qg@Vgs):55nC Input Capacitance (C; LCSC Part Name: 1个P沟道 耐压:80V 电流:28A; Supplier Part: C467910; Manufacturer: VISHAY(威世); Supplier Footprint: PowerPAK1212-8; JLCPCB Part Class: Extended Part; Datasheet: https://atta.szlcsc.com/upload/public/pdf/source/20191209/C467910_85F7E5149EC2375704E52F71B57F99EC.pdf; Supplier: LCSC; Type: 1 Piece P-Channel; Drain Source On Resistance (RDS(on)@Vgs,Id): 0.025Ω@10V,28A; Total Gate Charge (Qg@Vgs): 55nC; Input Capacitance (Ciss@Vds): 4.7nF@40V; Reverse Transfer Capacitance (Crss@Vds): 235pF@40V; Operating Temperature: -55℃~+150℃
R3 R12 = Res_0402: Supplier Footprint: 0402
R4 R23 R34 = KTR03EZPF1003: Type:Thick Film Resistor Resistance:100kΩ Tolerance:±1% Tolerance:±1% Power(Watts):100mW Voltage-Supply(Max):350V Temperature Coefficient:±100ppm/℃ Temperature Coefficient:±100ppm/℃ Operating Temperature:-55℃~+155℃ Operating Temperature:-55℃~+155℃; LCSC Part Name: 厚膜电阻 100kΩ ±1% 100mW; Supplier Part: C510119; Manufacturer: ROHM(罗姆); Supplier Footprint: 0603; JLCPCB Part Class: Extended Part; Datasheet: https://item.szlcsc.com/datasheet/KTR03EZPF1003/523936.html; Supplier: LCSC; Type: Thick Film Resistor; Tolerance: ±1%; Power(Watts): 100mW; Voltage-Supply(Max): 350V; Temperature Coefficient: ±100ppm/℃; Operating Temperature: -55℃~+155℃
R5 = 0603WAF2402T5E: Type:Thick Film Resistor Resistance:24kΩ Tolerance:±1% Tolerance:±1% Power(Watts):100mW Voltage-Supply(Max):75V Temperature Coefficient:±100ppm/℃ Temperature Coefficient:±100ppm/℃ Operating Temperature:-55℃~+155℃ Operating Temperature:-55℃~+155℃; LCSC Part Name: 24kΩ ±1% 100mW 厚膜电阻; Supplier Part: C23352; Manufacturer: UNI-ROYAL(厚声); Supplier Footprint: 0603; Datasheet: https://item.szlcsc.com/datasheet/0603WAF2402T5E/24085.html; Supplier: LCSC; Type: Thick Film Resistor; Tolerance: ±1%; Power(Watts): 100mW; Voltage-Supply(Max): 75V; Temperature Coefficient: ±100ppm/℃; Operating Temperature: -55℃~+155℃
R6 R13 R83-R86 = 0603WAF1001T5E: Type:Thick Film Resistors Resistance:1kΩ Tolerance:±1% Tolerance:±1% Power(Watts): Overload Voltage (Max): Temperature Coefficient:±100ppm/℃ Temperature Coefficient:±100ppm/℃ Operating Temperature Range:-55℃~+155℃ Operating Temperature Range:-55℃~+155℃; LCSC Part Name: 1kΩ ±1% 100mW 厚膜电阻; Supplier Part: C21190; Manufacturer: UNI-ROYAL(厚声); Supplier Footprint: 0603; JLCPCB Part Class: Basic Part; Datasheet: https://atta.szlcsc.com/upload/public/pdf/source/20200306/C422600_1E6D84923E4A46A82E41ADD87F860B5C.pdf; Supplier: LCSC; Type: Thick Film Resistors; Tolerance: ±1%; Temperature Coefficient: ±100ppm/℃; Operating Temperature Range: -55℃~+155℃
R25 = ARG05DTC5002: Type:Thin Film Resistor Resistance:50kΩ Tolerance:±0.5% Tolerance:±0.5% Power(Watts):125mW Voltage-Supply(Max):150V Temperature Coefficient:±25ppm/℃ Temperature Coefficient:±25ppm/℃ Operating Temperature:-55℃~+155℃ Operating Temperature:-55℃~+155℃; LCSC Part Name: 薄膜电阻 50kΩ ±0.5% 125mW; Supplier Part: C2828840; Manufacturer: Viking(光颉); Supplier Footprint: 0805; JLCPCB Part Class: Extended Part; Datasheet: https://item.szlcsc.com/datasheet/ARG05DTC5002/2977309.html; Supplier: LCSC; Type: Thin Film Resistor; Tolerance: ±0.5%; Power(Watts): 125mW; Voltage-Supply(Max): 150V; Temperature Coefficient: ±25ppm/℃; Operating Temperature: -55℃~+155℃
R26 = 0603WAF8202T5E: Type:Thick Film Resistor Resistance:82kΩ Tolerance:±1% Tolerance:±1% Power(Watts):100mW Voltage-Supply(Max):75V Temperature Coefficient:±100ppm/℃ Temperature Coefficient:±100ppm/℃ Operating Temperature:-55℃~+155℃ Operating Temperature:-55℃~+155℃; LCSC Part Name: 82kΩ ±1% 100mW 厚膜电阻; Supplier Part: C23254; Manufacturer: UNI-ROYAL(厚声); Supplier Footprint: 0603; JLCPCB Part Class: Basic Part; Datasheet: https://item.szlcsc.com/datasheet/0603WAF8202T5E/23981.html; Supplier: LCSC; Type: Thick Film Resistor; Tolerance: ±1%; Power(Watts): 100mW; Voltage-Supply(Max): 75V; Temperature Coefficient: ±100ppm/℃; Operating Temperature: -55℃~+155℃
R33 = 0603WAF2002T5E: Type:Thick Film Resistor Resistance:20kΩ Tolerance:±1% Tolerance:±1% Power(Watts):100mW Voltage-Supply(Max):75V Temperature Coefficient:±100ppm/℃ Temperature Coefficient:±100ppm/℃ Operating Temperature:-55℃~+155℃ Operating Temperature:-55℃~+155℃; LCSC Part Name: 20kΩ ±1% 100mW 厚膜电阻; Supplier Part: C4184; Manufacturer: UNI-ROYAL(厚声); Supplier Footprint: 0603; JLCPCB Part Class: Basic Part; Datasheet: https://item.szlcsc.com/datasheet/0603WAF2002T5E/4591.html; Supplier: LCSC; Type: Thick Film Resistor; Tolerance: ±1%; Power(Watts): 100mW; Voltage-Supply(Max): 75V; Temperature Coefficient: ±100ppm/℃; Operating Temperature: -55℃~+155℃
R65 R66 = 0402WGF1000TCE: Type:Thick Film Resistors Resistance: Tolerance:±1% Tolerance:±1% Power(Watts): Overload Voltage (Max): Temperature Coefficient:±200ppm/℃ Temperature Coefficient:±200ppm/℃ Operating Temperature Range:-55℃~+155℃ Operating Temperature Range:-55℃~+155℃; LCSC Part Name: 100Ω ±1% 62.5mW 厚膜电阻; Supplier Part: C25076; Manufacturer: UNI-ROYAL(厚声); Supplier Footprint: 0402; JLCPCB Part Class: Basic Part; Datasheet: https://atta.szlcsc.com/upload/public/pdf/source/20200306/C422600_1E6D84923E4A46A82E41ADD87F860B5C.pdf; Supplier: LCSC; Type: Thick Film Resistors; Tolerance: ±1%; Temperature Coefficient: ±200ppm/℃; Operating Temperature Range: -55℃~+155℃
TX60 = XT60PW-M: Power:- Output:- Input:- Size:- Interface:- Type:- Colour:Yellow MaximumCurrent:- Type:Horizontal plug RatedVoltage:- Type1:- NumberOfUSBHoles:- InterfaceType:Male MetalMaterial:- InsulationMaterial:- RatedCurrent:- RecommendedWireGauge:- FlameRetardantGr; LCSC Part Name: AMASS(艾迈斯)航模插头xt60连接器150公母对接pw锂电池公头 板插卧式XT60PW-M; Supplier Part: C98732; Manufacturer: AMASS(艾迈斯); JLCPCB Part Class: Extended Part; Datasheet: https://item.szlcsc.com/datasheet/XT60PW-M/99942.html; Supplier: LCSC; Type: Horizontal plug; Colour: Yellow; InterfaceType: Male
U4 = LTC4412ES6#TRPBF: Load Type:MOSFET Voltage - Supply:2.5V~28V Voltage - Supply:2.5V~28V Operating Temperature:-40℃~+85℃ Operating Temperature:-40℃~+85℃; LCSC Part Name: 低损耗PowerPath控制器; Supplier Part: C514442; Manufacturer: ADI(亚德诺); Supplier Footprint: TSOT-23-6; JLCPCB Part Class: Extended Part; Datasheet: https://item.szlcsc.com/datasheet/LTC4412ES6%2523TRPBF/529483.html; Supplier: LCSC; Load Type: MOSFET; Voltage - Supply: 2.5V~28V; Operating Temperature: -40℃~+85℃
U7 = AMS1117-3.3_C6186: Output Type:Fixed Voltage - Supply:16V Output Voltage:3.3V Output Voltage:3.3V Output Current:1A Power Supply Rejection Ratio (PSRR):72dB@(120Hz) Voltage Dropout:1.1V@(800mA) standby current:5mA Noise:0.003%Vout Features:Over Current Protection；Over Tempe; LCSC Part Name: 输出3.3V 1A; Supplier Part: C6186; Manufacturer: AMS; Supplier Footprint: SOT-223; JLCPCB Part Class: Basic Part; Datasheet: https://item.szlcsc.com/datasheet/AMS1117-3.3/6652.html; Supplier: LCSC; Output Type: Fixed; Voltage - Supply: 16V; Output Voltage: 3.3V; Output Current: 1A; Power Supply Rejection Ratio (PSRR): 72dB@(120Hz); Voltage Dropout: 1.1V@(800mA); standby current: 5mA; Noise: 0.003%Vout; Features: Over Current Protection；Over Temperature Protection; Operating Temperature: -40℃~+125℃; Output Configuration: Positive; Number of Outputs: 1
VR1 = 3362P-1-103LF: Resistance:10kΩ Tolerance:±10% Tolerance:±10% Power(Watts):500mW Temperature Coefficient:±100ppm/℃ Temperature Coefficient:±100ppm/℃ Number of Turns:; LCSC Part Name: 10kΩ ±10%; Supplier Part: C58159; Manufacturer: BOURNS; Supplier Footprint: 插件-3P,7x6.6mm; JLCPCB Part Class: Extended Part; Datasheet: https://item.szlcsc.com/datasheet/3362P-1-103LF/59198.html; Supplier: LCSC; Tolerance: ±10%; Power(Watts): 500mW; Temperature Coefficient: ±100ppm/℃

## Nets
3V3_SYS: 3V3_SYS.1 LED_GREEN3.2(A) QWIIC1.2 QWIIC2.2 QWIIC3.2 QWIIC4.2 R57.1 R59.2 R60.2 U5.1 U5.2 U5.3 U5.4 U7.2(VOUT) U7.4(VOUT) U31.1(VCCA) U31.5(OE)
5V15_OUT: 5V15_OUT.1 BUCK_1.1(BIAS) C14.1 C15.1 C16.1 C35.2 L1.2 LED_BLUE6.2(A) Q3.5(D) Q3.6(D) Q3.7(D) Q3.8(D) Q3.9(D) R4.1 R32.1 U4.1(VIN)
GND: 5V_SYS.1 BAT_IN.1 BTN1.3 BTN1.4 BTN2.3 BTN2.4 BTN3.3 BTN3.4 BTN4.3 BTN4.4 BTN5.3 BTN5.4 BTN6.3 BTN6.4 BTN7.3 BTN7.4 BTN8.3 BTN8.4 BTN9.3 BTN9.4 BTN10.3 BTN10.4 BUCK_1.3(AGND) BUCK_1.7(EN/SYNC) BUCK_1.8(VIN1) BUCK_1.9(PGND1) BUCK_1.11(PGND2) BUCK_1.12(VIN2) BUCK_2.3(AGND) BUCK_2.7(EN/SYNC) BUCK_2.8(VIN1) BUCK_2.9(PGND1) BUCK_2.11(PGND2) BUCK_2.12(VIN2) C7.2 C8.2 C9.1 C9.2 C10.1 C10.2 C13.1 C14.2 C15.2 C17.2 C18.2 C19.1 C19.2 C20.1 C20.2 C22.1 C23.2 C24.2 C31.1 C31.2 C32.1 C32.2 C33.1 C33.2 C34.1 C34.2 C35.1 CBB5.12(GND) CBB6.12(GND) D1.1(K) D2.1(GND) D2.2(GND) D2.3(GND) D2.7(GND) J1.1(5V) J1.3(5V) J1.5(GND) LED_BLUE1.2(A) LED_BLUE2.2(A) LED_BLUE4.2(A) LED_BLUE5.2(A) LED_GREEN1.2(A) LED_GREEN4.2(A) LED_ORANGE1.2(A) LIM_1.1 LIM_1.2 LIM_2.1 LIM_2.2 LIM_3.1 LIM_3.2 LIM_4.1 LIM_4.2 LIM_5.1 LIM_5.2 LIM_6.1 LIM_6.2 LIM_7.1 LIM_7.2 LIM_8.1 LIM_8.2 M1_ENC1.2 M1_ENC1.4 M2_ENC1.2 M2_ENC1.4 M3_ENC1.2 M3_ENC1.4 M4_ENC1.2 M4_ENC1.4 NEO_PIXEL.1 NEO_PIXEL.3 P1.2 P1.5 P1.6 Q2.3(S) Q3.1(S) Q3.2(S) Q3.3(S) QWIIC1.1 QWIIC1.5 QWIIC1.6 QWIIC2.1 QWIIC2.5 QWIIC2.6 QWIIC3.1 QWIIC3.5 QWIIC3.6 QWIIC4.1 QWIIC4.5 QWIIC4.6 QWIIC5.1 QWIIC5.5 QWIIC5.6 QWIIC6.1 QWIIC6.5 QWIIC6.6 R3.2 R5.2 R12.2 R22.2 R23.2 R24.2 R25.2 R27.2 R28.2 R30.2 R34.1 R57.2 R73.2 R83.2 R84.2 R85.2 R86.2 R92.2 R94.2 R95.2 R96.2 R97.2 R100.1 R101.1 RGB_LED.2(GND) RGB_LED.4(VDD) ST1.(A2) ST2.(A2) ST3.(A2) ST4.(A2) STP1.1 STP1.2 STP1.3 STP1.4 STP2.1 STP2.2 STP2.3 STP2.4 STP3.1 STP3.2 STP3.3 STP3.4 STP4.1 STP4.2 STP4.3 STP4.4 TX60.1(-) TX60.3 TX60.4 U4.2(GND) U4.3(CTL) U4.6(SENSE) U5.5 U5.6 U5.7 U5.8 U6.1 U6.2 U6.3 U6.4 U6.5 U6.6 U6.7 U6.8 U6.9 U6.10 U6.11 U6.12 U7.1(GND) U7.3(VIN) U13.1(5V) U13.2(GPIO22) U13.3(GPIO24) U13.7(GPIO32) U13.18(GND) U13.19(GND) U13.30(GPIO33) U13.34(GPIO25) U13.35(GPIO23) U13.36(5V) U13.41(5V) U13.42(GND) U13.43(GND) U13.66(GND) U13.82(GPIO14) U13.83(GPIO15) U31.4(GND) U31.8(VCCB) U42.2 U42.4 U42.6 U43.1 U43.2 U43.3 U43.6 U43.7 U44.10 U44.11 U46.5 U46.6 U46.12 U47.1 U53.2(GND) U53.7(VCCB)
AIN_5V15_OUT: R28.1 R32.2 U13.47(A1)
AIN_BAT: R24.1 R25.1 U13.46(A0)
AIN_SERVO_V_OUT: R30.1 R33.2 U13.48(A2)
BTN_1: BTN1.1 BTN1.2 U13.10(GPIO38)
BTN_2: BTN2.1 BTN2.2 U13.27(GPIO39)
BTN_3: BTN3.1 BTN3.2 LIM_1.3 U13.11(GPIO40) U47.12
BTN_4: BTN4.1 BTN4.2 LIM_2.3 U13.26(GPIO41) U47.11
BTN_5: BTN5.1 BTN5.2 LIM_3.3 U13.15(GPIO48) U47.7
BTN_6: BTN6.1 BTN6.2 LIM_4.3 U13.22(GPIO49) U47.6
BTN_7: BTN7.1 BTN7.2 LIM_5.3 U13.16(GPIO50) U47.5
BTN_8: BTN8.1 BTN8.2 LIM_6.3 U13.21(GPIO51) U47.4
BTN_9: BTN9.1 BTN9.2 LIM_7.3 U13.17(GPIO52) U47.3
BTN_10: BTN10.1 BTN10.2 LIM_8.3 U13.20(GPIO53) U47.2
BUCK1_FB: BUCK_1.4(FB) R4.2 R5.1 R6.2
BUCK1_PGOOD: BUCK1_PGOOD.1 BUCK_1.5(PGOOD)
BUCK2_FB: BUCK_2.4(FB) R13.2 R26.2 VR1.2
BUCK2_PGOOD: BUCK2_PGOOD.1 BUCK_2.5(PGOOD)
LED_BLUE: LED_BLUE.2(A) U13.24(GPIO45) U47.10
LED_GREEN: LED_GREEN.2(A) U13.13(GPIO44)
LED_ORANGE: LED_ORANGE.2(A) U13.14(GPIO46) U47.9
LED_PURPLE: LED_PURPLE.2(A) U13.23(GPIO47) U47.8
LED_RED: LED_RED.2(A) U13.75(GPIO5)
M1_CT: CBB6.11(A_CT) U13.49(A3)
M1_EN: CBB6.9(A_EN) U13.74(GPIO6)
M1_ENC_A: M1_ENC1.3 U13.78(GPIO2)
M1_ENC_B: M1_ENC1.1 U13.77(GPIO3)
M1_IN1: CBB6.5(A_IN1) U13.72(GPIO8)
M1_IN2: CBB6.7(A_IN2) U13.25(GPIO43)
M2_CT: CBB6.4(B_CT) U13.50(A4)
M2_EN: CBB6.3(B_EN) U13.73(GPIO7)
M2_ENC_A: M2_ENC1.3 U13.86(GPIO18)
M2_ENC_B: M2_ENC1.1 U13.87(GPIO19)
M2_IN1: CBB6.1(B_IN1) U13.76(GPIO4)
M2_IN2: CBB6.2(B_IN2) U13.6(GPIO30)
M3_CT: CBB5.11(A_CT) U13.51(A5)
M3_EN: CBB5.9(A_EN) U13.71(GPIO9) U43.12
M3_ENC_A: M3_ENC1.3 U13.61(A14) U44.8
M3_ENC_B: M3_ENC1.1 U13.62(A15) U44.9
M3_IN1: CBB5.5(A_IN1) U13.8(GPIO34) U46.4
M3_IN2: CBB5.7(A_IN2) U13.29(GPIO35) U46.3
M4_CT: CBB5.4(B_CT) U13.52(A6)
M4_EN: CBB5.3(B_EN) U13.70(GPIO10) U43.11
M4_ENC_A: M4_ENC1.3 U13.69(GPIO11) U43.10
M4_ENC_B: M4_ENC1.1 U13.68(GPIO12) U43.9
M4_IN1: CBB5.1(B_IN1) U13.9(GPIO36) U46.2
M4_IN2: CBB5.2(B_IN2) U13.28(GPIO37) U46.1
MEGA_RX: R98.1 SHORT_MEGA_RX.1 U13.85(GPIO17) U53.8(B1)
MEGA_SCL: P1.4 SHORT_SCL.2 U13.89(GPIO21) U31.6(B2) U43.4
MEGA_SDA: P1.3 SHORT_SDA.2 U13.88(GPIO20) U31.7(B1) U43.5
MEGA_TX: R99.1 SHORT_MEGA_TX.1 U13.84(GPIO16) U53.1(B2)
PWR_STAT: R34.2 U4.4(STAT)
QWIIC_SCL: QWIIC1.4 QWIIC2.4 QWIIC3.4 QWIIC4.4 R60.1 SHORT_SCL.1 U31.3(A2)
QWIIC_SDA: QWIIC1.3 QWIIC2.3 QWIIC3.3 QWIIC4.3 R59.1 SHORT_SDA.1 U31.2(A1)
RGB_LED_D: RGB_LED.3(DI) U13.12(GPIO42)
RPI_3V3: J1.18(3.3V) QWIIC5.2 QWIIC6.2 R73.1 U42.17 U53.3(VCCA) U53.6(OE)
RPI_RX: J1.9(UART_RXD) SHORT_MEGA_TX.2 U42.10 U53.4(A2)
RPI_SCL: J1.6(I2C_SCL) QWIIC5.4 QWIIC6.4 U42.5
RPI_SDA: J1.4(I2C_SDA) QWIIC5.3 QWIIC6.3 U42.3
RPI_TX: SHORT_MEGA_RX.2 U42.8 U53.5(A1)
SERVO_V_OUT: BUCK_2.1(BIAS) C23.1 C24.1 C25.1 L2.2 LED_BLUE7.2(A) R33.1 servo_v+.2 SERVO_V_OUT.1 U5.9 U5.10 U5.11 U5.12
ST1_EN: R87.2 ST1.1(EN) U13.4(GPIO26) U46.11
ST2_EN: R88.2 ST2.1(EN) U13.33(GPIO27) U46.10
ST3_EN: R91.2 ST3.1(EN) U13.5(GPIO28) U46.9
ST4_EN: R90.2 ST4.1(EN) U13.32(GPIO29) U46.8
USER_A7: U13.53(A7) U44.1
USER_A8: U13.55(A8) U44.2
USER_A9: U13.56(A9) U44.3
USER_A10: U13.57(A10) U44.4
USER_A11: U13.58(A11) U44.5
USER_A12: U13.59(A12) U44.6
USER_A13: U13.60(A13) U44.7
USER_GPIO13: LED_ORANGE2.2(A) U13.67(GPIO13) U43.8
USER_GPIO31: U13.31(GPIO31) U46.7
USER_MEGA_3V3: U13.40(3.3V) U44.12
$1N3025: BUCK_1.10(SW) C12.2 L1.1
$1N3134: BUCK_1.6(RT) R3.1
$1N4233: BUCK_1.14(CBOOT) C12.1 R65.2
$1N4314: BUCK_1.2(VCC) C13.2
$1N4953: C16.2 R6.1
$1N6776: BUCK_2.10(SW) C21.2 L2.1
$1N6777: BUCK_2.6(RT) R12.1
$1N6780: BUCK_2.2(VCC) C22.2
$1N6801: C25.2 R13.1
$1N12799: F1.3 F1.4 Q2.4(D)
$1N13029: D1.2(A) Q2.1(G) R22.1 R23.1
$1N13128: D2.4(IN) D2.5(IN) D2.6(IN) F1.1 F1.2 TX60.2(+)
$1N19562: BUCK_2.14(CBOOT) C21.1 R66.2
$1N19604: BUCK_2.13(RBOOT) R66.1
$1N19609: BUCK_1.13(RBOOT) R65.1
$1N31029: Q3.4(G) U4.5(GATE)
$1N34859: LED_BLUE6.1(K) R83.1
$1N34948: LED_BLUE7.1(K) R84.1
$1N35382: LED_GREEN4.1(K) R85.1
$1N35390: LED_GREEN3.1(K) R86.1
$3N9653: LED_ORANGE.1(K) R92.1
$3N9692: LED_RED.1(K) R94.1
$3N9731: LED_GREEN.1(K) R95.1
$3N9770: LED_BLUE.1(K) R96.1
$3N9809: LED_PURPLE.1(K) R97.1
$3N9921: NEO_PIXEL.2 RGB_LED.1(DO)
$3N16001: P1.1 servo_v+.1
$3N16090: LED_BLUE1.1(K) R87.1
$3N16219: LED_BLUE2.1(K) R88.1
$3N16397: LED_BLUE4.1(K) R90.1
$3N16486: LED_BLUE5.1(K) R91.1
$4N7198: J1.8(GPIO4) U42.7
$4N7204: J1.10(GND) U42.9
$4N7209: J1.12(GPIO17) U42.11
$4N7215: J1.14(GPIO27) U42.13
$4N7221: J1.16(GPIO22) U42.15
$4N7238: J1.20(SPI_MOSI) U42.19
$4N7244: J1.22(SPI_MISO) U42.21
$4N7250: J1.24(SPI_SLK) U42.23
$4N7256: J1.26(GND) U42.25
$4N7262: J1.28(ID SD) U42.27
$4N7268: J1.30(GPIO5) U42.29
$4N7274: J1.32(GPIO6) U42.31
$4N7280: J1.34(GPIO13) U42.33
$4N7286: J1.36(GPIO19) U42.35
$4N7292: J1.38(GPIO26) U42.37
$4N7298: J1.40(GND) U42.39
$4N7349: J1.11(GPIO18) U42.12
$4N7373: J1.39(GPIO21) U42.40
$4N7396: J1.37(GPIO20) U42.38
$4N7422: J1.35(GPIO16) U42.36
$4N7438: J1.33(GND) U42.34
$4N7447: J1.31(GPIO12) U42.32
$4N7456: J1.29(GND) U42.30
$4N7465: J1.27(ID SC) U42.28
$4N7474: J1.25(SPI_CE1) U42.26
$4N7483: J1.23(SPI_CE0) U42.24
$4N7492: J1.21(GPIO25) U42.22
$4N7500: J1.19(GND) U42.20
$4N7509: J1.17(GPIO24) U42.18
$4N7518: J1.15(GPIO23) U42.16
$4N7527: J1.13(GND) U42.14
$4N7701: J1.2(3.3V) U42.1
$4N14549: LED_GREEN1.1(K) R98.2
$4N17177: LED_ORANGE2.1(K) R101.2
$4N17189: LED_GREEN2.1(K) R100.2
$4N17194: LED_ORANGE1.1(K) R99.2

Not connected (* = marked no-connect by the designer): C7 1; C8 1; C17 1; C18 1; J1 7(UART_TXD); LED_GREEN2 2(A); R26 1; R27 1; U13 37(NC)* 38(IOREF)* 39(RESET)* 44(VIN)* 63(SCL1)* 64(SDA1)* 65(AREF)* 79(GPIO1)* 80(GPIO0)*; VR1 1* 3

## Notes on the sheets
sheet 1
- *Body diode | -->
- *drain
- *source
- Power Input
- LED Indications
- Buck Converters & 3V3
- *Common source back-to-back PMOS
- Monitoring
- Ideal Diode
- Power Outputs
sheet 2
- H-Bridges
- User Buttons
- Steppers and Limit Switches
- LEDs
- PCA9685
sheet 3
- Limit Switches
- Exposed GPIO pins (user pins)
- QWIIC BANK 1 (5V/3V3)
- QWIIC BANK 2 (5V/3V3)
- QWIIC BANK 3 (3V3)
- QWIIC
